# EasyEDA Pro project esp32_final.eprj

# Schematic SCH

## Sheets
1 ESP32
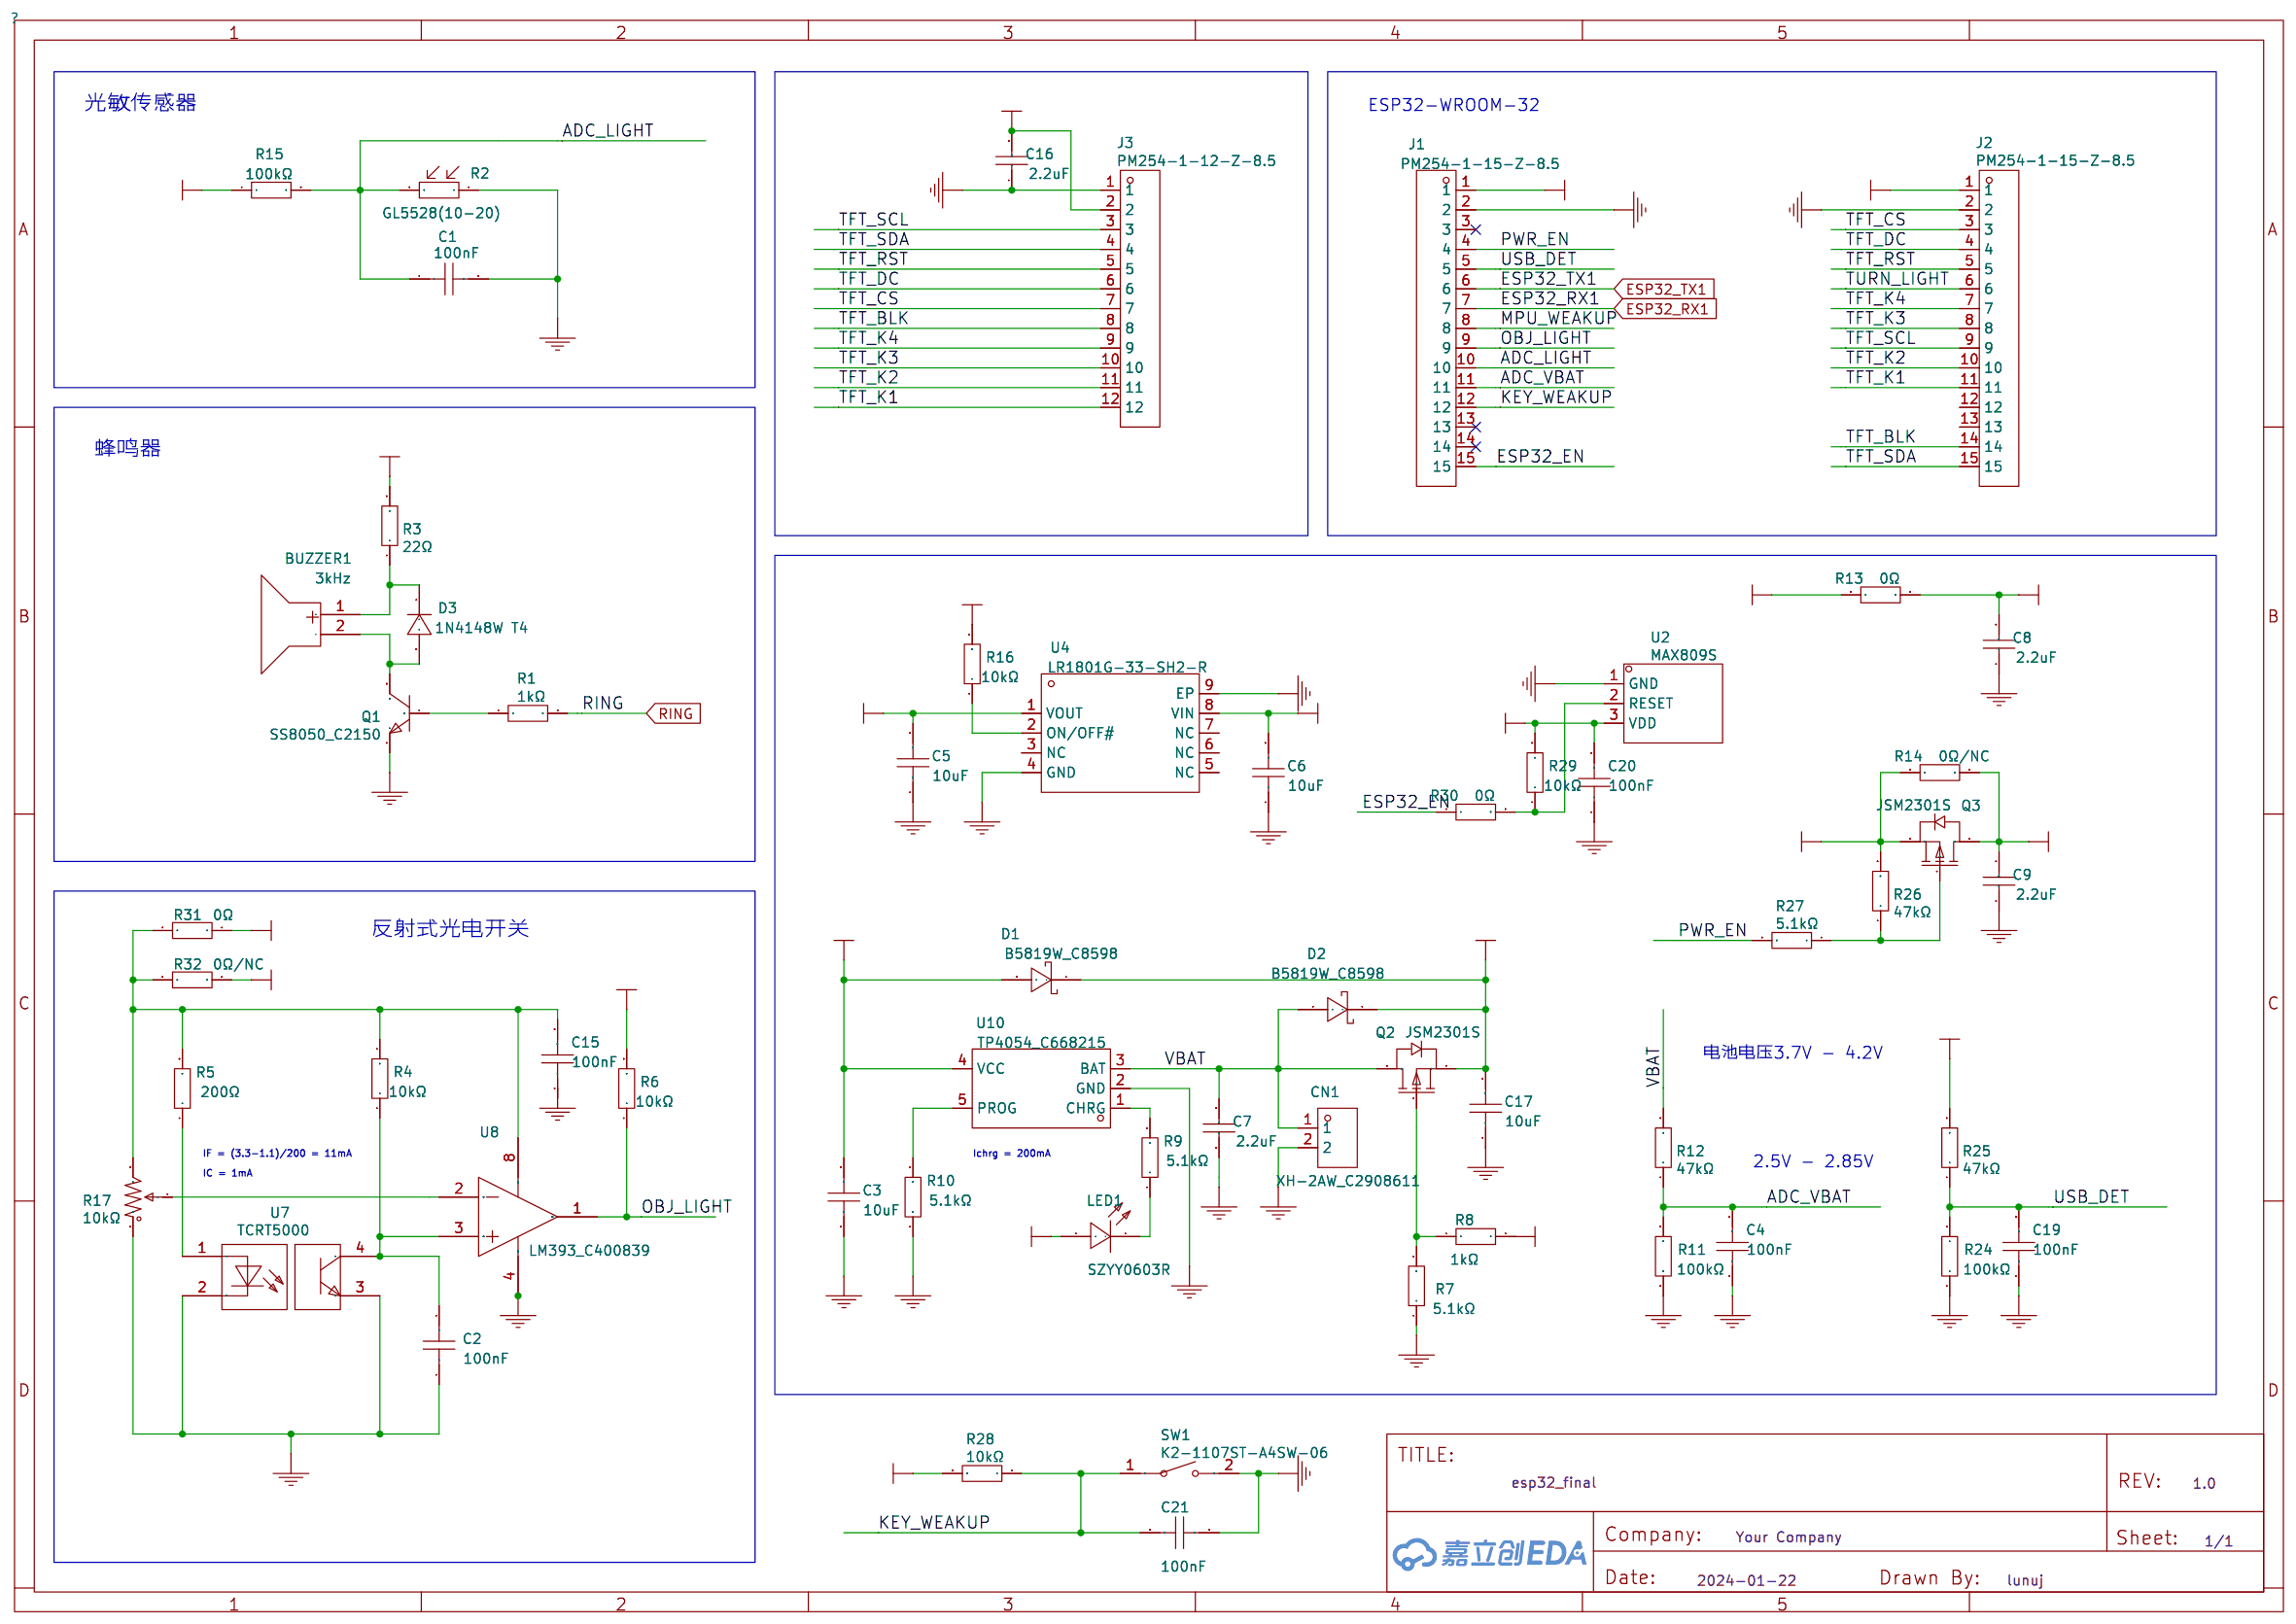
[diagram p0: ESP32]
2 STM32
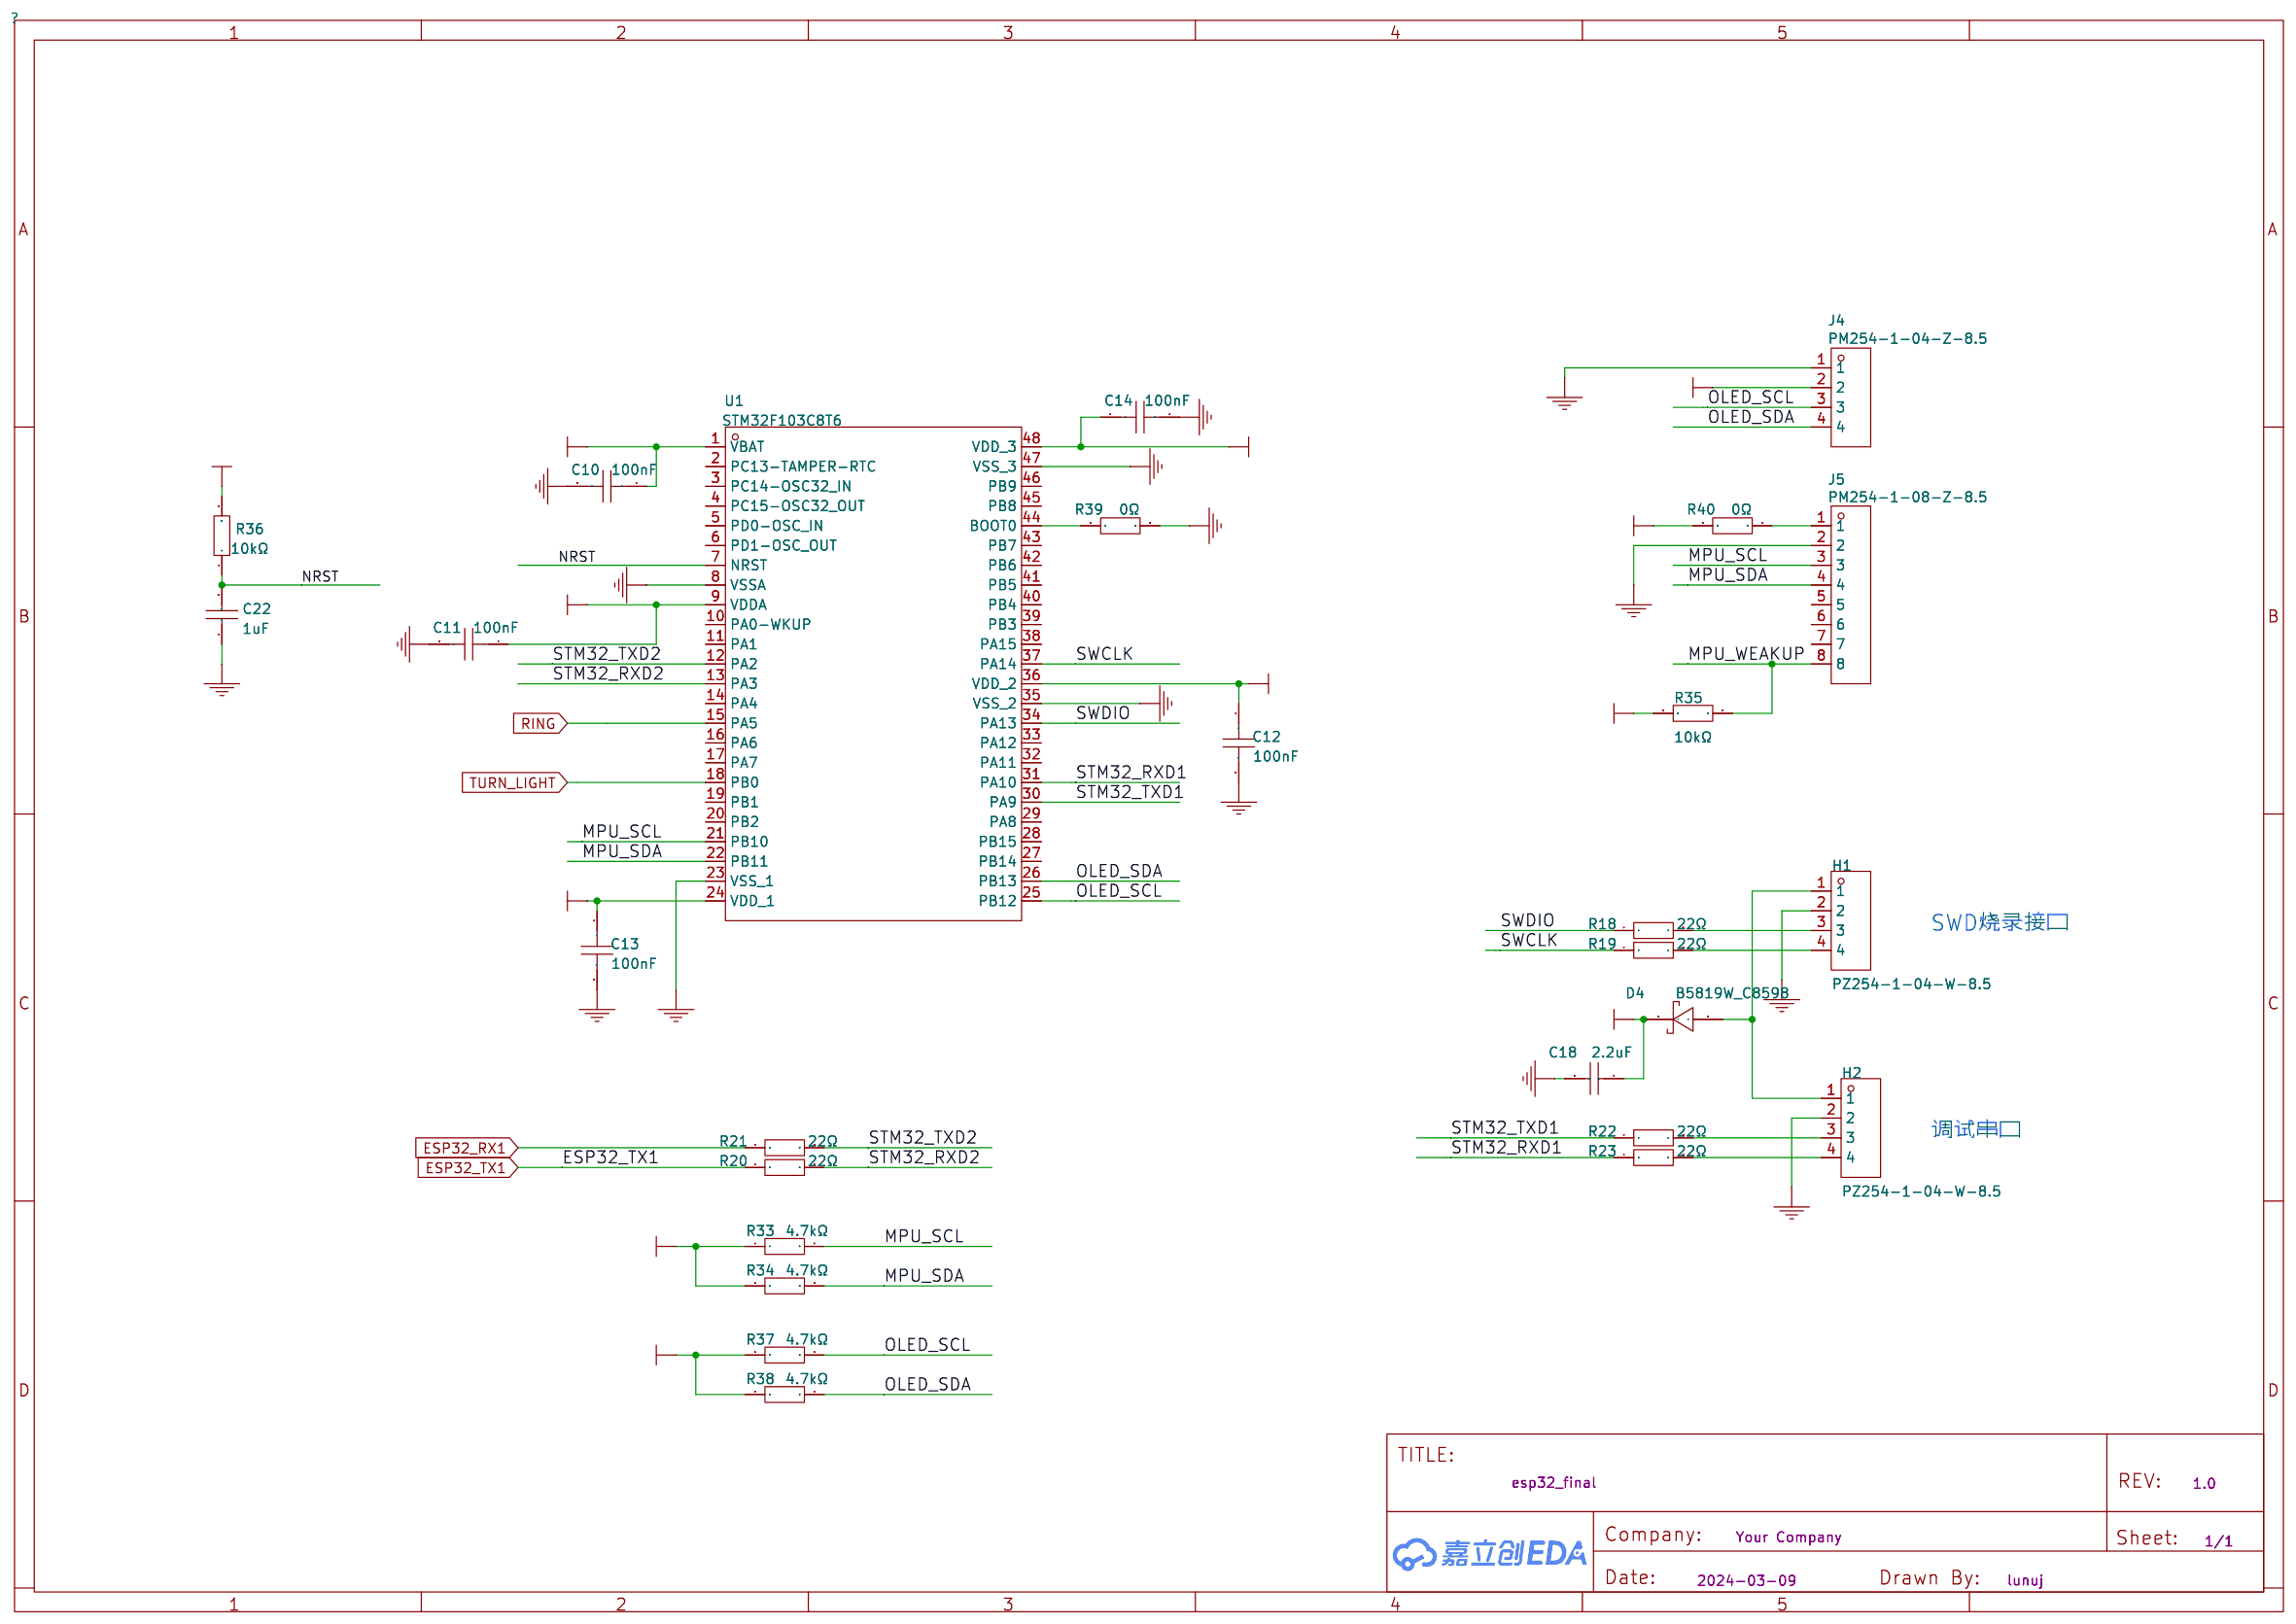
[diagram p1: STM32]

## Parts
sheet ESP32
BUZZER1  3kHz  [footprint_b725]
C1  100nF  [footprint_9e9b]
C2  100nF  [footprint_9e9b]
C3  10uF  [footprint_9e9b]
C4  100nF  [footprint_9e9b]
C5  10uF  [footprint_9e9b]
C6  10uF  [footprint_9e9b]
C7  2.2uF  [footprint_9e9b]
C8  2.2uF  [footprint_9e9b]
C9  2.2uF  [footprint_9e9b]
C15  100nF  [footprint_9e9b]
C16  2.2uF  [footprint_9e9b]
C17  10uF  [footprint_9e9b]
C19  100nF  [footprint_9e9b]
C20  100nF  [footprint_9e9b]
C21  100nF  [footprint_9e9b]
CN1  XH-2AW_C2908611  [footprint_45c2]
D1  B5819W_C8598  [footprint_217f]
D2  B5819W_C8598  [footprint_217f]
D3  1N4148W T4  [footprint_2996]
J1  PM254-1-15-Z-8.5  [footprint_1582]
J2  PM254-1-15-Z-8.5  [footprint_1582]
J3  PM254-1-12-Z-8.5  [footprint_c90a]
LED1  SZYY0603R  [footprint_3a94]
Q1  SS8050_C2150  [footprint_40fb]
Q2  JSM2301S  [footprint_40fb]
Q3  JSM2301S  [footprint_40fb]
R1  1kΩ  [footprint_ff81]
R2  GL5528(10-20)  [footprint_7788]
R3  22Ω  [footprint_ff81]
R4  10kΩ  [footprint_ff81]
R5  200Ω  [footprint_ff81]
R6  10kΩ  [footprint_ff81]
R7  5.1kΩ  [footprint_ff81]
R8  1kΩ  [footprint_ff81]
R9  5.1kΩ  [footprint_ff81]
R10  5.1kΩ  [footprint_ff81]
R11  100kΩ  [footprint_ff81]
R12  47kΩ  [footprint_ff81]
R13  0Ω  [footprint_ff81]
R14  0Ω/NC  [footprint_ff81]
R15  100kΩ  [footprint_ff81]
R16  10kΩ  [footprint_ff81]
R17  10kΩ  [footprint_5b8b]
R24  100kΩ  [footprint_ff81]
R25  47kΩ  [footprint_ff81]
R26  47kΩ  [footprint_ff81]
R27  5.1kΩ  [footprint_ff81]
R28  10kΩ  [footprint_ff81]
R29  10kΩ  [footprint_ff81]
R30  0Ω  [footprint_ff81]
R31  0Ω  [footprint_ff81]
R32  0Ω/NC  [footprint_ff81]
SW1  K2-1107ST-A4SW-06  [footprint_5031]
U2  MAX809S  [footprint_40fb]
U4  LR1801G-33-SH2-R  [footprint_c089]
U7  TCRT5000  [footprint_17ac]
U8  LM393_C400839  [footprint_6934]
U10  TP4054_C668215  [footprint_0cd8]
sheet STM32
C10  100nF  [footprint_9e9b]
C11  100nF  [footprint_9e9b]
C12  100nF  [footprint_9e9b]
C13  100nF  [footprint_9e9b]
C14  100nF  [footprint_9e9b]
C18  2.2uF  [footprint_9e9b]
C22  1uF  [C0603]
D4  B5819W_C8598  [footprint_217f]
H1  PZ254-1-04-W-8.5  [HDR-TH_04P-P2.54-H-M-W10.4-N]
H2  PZ254-1-04-W-8.5  [HDR-TH_04P-P2.54-H-M-W10.4-N]
J4  PM254-1-04-Z-8.5  [footprint_a6c7]
J5  PM254-1-08-Z-8.5  [footprint_d2a7]
R18  22Ω  [footprint_ff81]
R19  22Ω  [footprint_ff81]
R20  22Ω  [footprint_ff81]
R21  22Ω  [footprint_ff81]
R22  22Ω  [footprint_ff81]
R23  22Ω  [footprint_ff81]
R33  4.7kΩ  [R0603]
R34  4.7kΩ  [R0603]
R35  10kΩ  [footprint_ff81]
R36  10kΩ  [footprint_ff81]
R37  4.7kΩ  [R0603]
R38  4.7kΩ  [R0603]
R39  0Ω  [footprint_ff81]
R40  0Ω  [footprint_ff81]
U1  STM32F103C8T6  [footprint_1eac]

## Library data of the parts
BUZZER1 = 3kHz: Supplier: LCSC; Supplier Part: C96102; Manufacturer: 华能; Manufacturer Part: HNB09A03; JLCPCB Part Class: Extended Part
C1 C2 C4 C10-C15 C19-C21 = 100nF: Supplier: LCSC; Manufacturer: SAMSUNG(三星); Manufacturer Part: CL10B104KB8NNNC; Supplier Part: C1591; JLCPCB Part Class: Extended Part
C3 C5 C6 C17 = 10uF: Supplier: LCSC; Manufacturer: SAMSUNG(三星); Manufacturer Part: CL10A106KP8NNNC; Supplier Part: C19702; JLCPCB Part Class: Basic Part
C7-C9 C16 C18 = 2.2uF: Supplier: LCSC; Manufacturer Part: CL10A225KP8NNNC; Manufacturer: SAMSUNG(三星); Supplier Part: C1607; JLCPCB Part Class: Extended Part
CN1 = XH-2AW_C2908611: Supplier: LCSC; Supplier Part: C2908611; Manufacturer: HCTL(华灿天禄); Manufacturer Part: XH-2AW; JLCPCB Part Class: Extended Part
D1 D2 D4 = B5819W_C8598: Supplier: LCSC; Manufacturer: CJ(江苏长电/长晶); Manufacturer Part: B5819W SL; Supplier Part: C8598; JLCPCB Part Class: Basic Part
D3 = 1N4148W T4: Supplier: LCSC; Manufacturer: CJ(江苏长电/长晶); Manufacturer Part: 1N4148W; Supplier Part: C2099; JLCPCB Part Class: Extended Part
J1 J2 = PM254-1-15-Z-8.5: Supplier: LCSC; Supplier Part: C2897378; Manufacturer: HCTL(华灿天禄); JLCPCB Part Class: Extended Part
J3 = PM254-1-12-Z-8.5: Supplier: LCSC; Supplier Part: C2897375; Manufacturer: HCTL(华灿天禄); JLCPCB Part Class: Extended Part
LED1 = SZYY0603R: Supplier: LCSC; Supplier Part: C434419; Manufacturer: yongyu(永裕光电); JLCPCB Part Class: Extended Part
Q1 = SS8050_C2150: Supplier: LCSC; Manufacturer: CJ(江苏长电/长晶); Manufacturer Part: SS8050; Supplier Part: C2150; JLCPCB Part Class: Basic Part
Q2 Q3 = JSM2301S: Supplier: LCSC; Supplier Part: C916399; Manufacturer: JSMSEMI(杰盛微); JLCPCB Part Class: Extended Part
R1 R8 = 1kΩ: Supplier: LCSC; Manufacturer Part: RC0603FR-071KL; Manufacturer: YAGEO(国巨); Supplier Part: C22548; JLCPCB Part Class: Extended Part
R2 = GL5528(10-20): Supplier: LCSC; Manufacturer: JCHL(晶创和立); Supplier Part: C10081; JLCPCB Part Class: Extended Part
R3 R18-R23 = 22Ω: Supplier: LCSC; Manufacturer: UNI-ROYAL(厚声); Manufacturer Part: 0603WAF220JT5E; Supplier Part: C23345; JLCPCB Part Class: Basic Part
R4 R6 R16 R28 R29 R35 R36 = 10kΩ: Supplier: LCSC; Manufacturer: UNI-ROYAL(厚声); Manufacturer Part: 0603WAF1002T5E; Supplier Part: C25804; JLCPCB Part Class: Basic Part
R5 = 200Ω: Supplier: LCSC; Manufacturer: UNI-ROYAL(厚声); Manufacturer Part: 0603WAJ0201T5E; Supplier Part: C25217; JLCPCB Part Class: Extended Part
R7 R9 R10 R27 = 5.1kΩ: Supplier: LCSC; Manufacturer Part: 0603WAF5101T5E; Manufacturer: UNI-ROYAL(厚声); Supplier Part: C23186; JLCPCB Part Class: Basic Part
R11 R15 R24 = 100kΩ: Supplier: LCSC; Supplier Part: C14675; Manufacturer: YAGEO(国巨); Manufacturer Part: RC0603FR-07100KL; JLCPCB Part Class: Extended Part
R12 R25 R26 = 47kΩ: Supplier: LCSC; Manufacturer: UNI-ROYAL(厚声); Manufacturer Part: 0603WAF4702T5E; Supplier Part: C25819; JLCPCB Part Class: Basic Part
R13 R30-R32 R39 R40 = 0Ω: Supplier: LCSC; Manufacturer: UNI-ROYAL(厚声); Manufacturer Part: 0603WAF0000T5E; Supplier Part: C21189; JLCPCB Part Class: Basic Part
R14 = 0Ω/NC: Supplier: LCSC; Manufacturer: UNI-ROYAL(厚声); Manufacturer Part: 0603WAF0000T5E; Supplier Part: C21189; JLCPCB Part Class: Basic Part
R17 = 10kΩ: Resistance: 10K; Supplier: LCSC; Supplier Part: C118956; Manufacturer: BOCHEN(博晨); Manufacturer Part: 3362P-1-103; JLCPCB Part Class: Extended Part
SW1 = K2-1107ST-A4SW-06: Supplier: LCSC; Supplier Part: C118141; Manufacturer: 韩国韩荣; Manufacturer Part: K2-1107ST-A4DW-06; JLCPCB Part Class: Extended Part
U2 = MAX809S: Supplier: LCSC; Supplier Part: C347371; Manufacturer: UMW(友台半导体); JLCPCB Part Class: Extended Part
U4 = LR1801G-33-SH2-R: Supplier: LCSC; Supplier Part: C410479; Manufacturer: UTC(友顺); JLCPCB Part Class: Extended Part
U7 = TCRT5000: Supplier: LCSC; Supplier Part: C2984661; Manufacturer: VISHAY(威世); JLCPCB Part Class: Extended Part
U8 = LM393_C400839: Supplier: LCSC; Supplier Part: C400839; Manufacturer: IDCHIP(英锐芯); Manufacturer Part: LM393; JLCPCB Part Class: Extended Part
U10 = TP4054_C668215: Supplier: LCSC; Supplier Part: C668215; Manufacturer: UMW(友台半导体); Manufacturer Part: TP4054; JLCPCB Part Class: Extended Part
C22 = CL10A105KO8NNNC: 容值:1uF;精度:±10%;额定电压:16V;材质(温度系数):X5R;; LCSC Part Name: 1uF ±10% 16V; Supplier Part: C1592; Manufacturer: SAMSUNG(三星); Supplier Footprint: 0603; JLCPCB Part Class: 扩展库; Datasheet: https://atta.szlcsc.com/upload/public/pdf/source/20220919/9FBE606BE0D9532D730F292EB26DC5BB.pdf; Supplier: LCSC; Tolerance: ±10%; Voltage Rated: 16V; Temperature Coefficient: X5R
H1 H2 = PZ254-1-04-W-8.5: 插针结构:1x4P;间距:2.54mm;行距:-;圆针/方针:方针;安装类型:弯插;排数:单排;总PIN位数:4P;额定电流:3A;额定电压:-;配合针长度:6mm;塑高:2.5mm;端接针长度:-;触头材质:-;工作温度范围:-40℃~+105℃;焊接温度(最大值):260℃@10S;颜色:黑色;; LCSC Part Name: 1x4P 间距:2.54mm 方针 弯插; Supplier Part: C2894946; Manufacturer: HCTL(华灿天禄); Supplier Footprint: 弯插,P=2.54mm; JLCPCB Part Class: 扩展库; Datasheet: https://atta.szlcsc.com/upload/public/pdf/source/20230609/872AF364EDF8DB2CAF0930EAB94ECB6E.pdf; Supplier: LCSC; Pin Structure: 1x4P; Pitch: 2.54mm; Circluar Pins/Square Pins: 方针; Mounting Type: 弯插; Number of Rows: 单排; Number of Pins: 4P; Current Rating (Max): 3A; Length of Mating Pin: 6mm; Insulation Height: 2.5mm; Operating Temperature Range: -40℃~+105℃; Soldering Temperature(Max): 260℃@10S; Color: 黑色
J4 = PM254-1-04-Z-8.5: Supplier: LCSC; Supplier Part: C2897367; Manufacturer: HCTL(华灿天禄); JLCPCB Part Class: Extended Part
J5 = PM254-1-08-Z-8.5: Supplier: LCSC; Supplier Part: C2897371; Manufacturer: HCTL(华灿天禄); JLCPCB Part Class: Extended Part
R33 R34 R37 R38 = 0603WAF4701T5E: 电阻类型:厚膜电阻;阻值:4.7kΩ;精度:±1%;功率:100mW;最大工作电压:75V;温度系数:±100ppm/℃;; LCSC Part Name: 4.7kΩ ±1% 100mW 厚膜电阻; Supplier Part: C23162; Manufacturer: UNI-ROYAL(厚声); Supplier Footprint: 0603; JLCPCB Part Class: 基础库; Datasheet: https://atta.szlcsc.com/upload/public/pdf/source/20200306/C422600_1E6D84923E4A46A82E41ADD87F860B5C.pdf; Supplier: LCSC; Type: 厚膜电阻; Tolerance: ±1%; Power(Watts): 100mW; Overload Voltage (Max): 75V; Temperature Coefficient: ±100ppm/℃; Operating Temperature Range: -55℃~+155℃
U1 = STM32F103C8T6: Supplier Part: C8734; Supplier: LCSC; Manufacturer: ST(意法半导体); JLCPCB Part Class: Extended Part

## Nets
GND: C1.2 C2.1 C3.1 C4.1 C5.1 C6.1 C7.1 C8.1 C9.1 C10.2 C11.2 C12.2 C13.2 C14.1 C15.1 C16.1 C17.1 C18.2 C19.1 C20.1 C21.1 C22.1 CN1.2 H1.2 H2.2 J1.2 J2.2 J3.1 J4.1 J5.2 Q1.2(E) R2.1 R7.1 R10.1 R11.1 R17.1 R24.1 R39.2 SW1.2 U1.8(VSSA) U1.23(VSS_1) U1.35(VSS_2) U1.47(VSS_3) U2.1(GND) U4.4(GND) U4.9(EP) U7.2 U7.3 U8.4(GND) U10.2(GND)
V33: C5.2 Q3.2(S) R13.1 R14.1 R26.2 U4.1(VOUT)
VBAT: C7.2 CN1.1 D2.2(+) Q2.3(D) R12.2 U10.3(BAT)
VBUS: C6.2 C17.2 D1.1(-) D2.1(-) Q2.2(S) R16.2 R40.1 U4.8(VIN)
VCC3V3: C9.2 C10.1 C11.1 C12.1 C13.1 C14.2 C16.2 C18.1 D4.1(-) J3.2 J4.2 Q3.3(D) R3.2 R14.2 R15.1 R32.1 R33.1 R34.1 R36.2 R37.1 R38.1 U1.1(VBAT) U1.9(VDDA) U1.24(VDD_1) U1.36(VDD_2) U1.48(VDD_3)
VDD3V3: C8.2 C20.2 J2.1 R6.2 R13.2 R28.2 R29.2 R31.1 R35.2 U2.3(VDD)
VIN: C3.2 D1.2(+) J1.1 LED1.1(+) R8.2 R25.2 U10.4(VCC)
ADC_LIGHT: C1.1 J1.10 R2.2 R15.2
ADC_VBAT: C4.2 J1.11 R11.2 R12.1
ESP32_EN: J1.15 R30.1
ESP32_RX1: J1.7 R21.1
ESP32_TX1: J1.6 R20.1
H1_1: D4.2(+) H1.1 H2.1
H1_3: H1.3 R18.2
H1_4: H1.4 R19.2
H2_3: H2.3 R22.2
H2_4: H2.4 R23.2
KEY_WEAKUP: C21.2 J1.12 R28.1 SW1.1
MPU_SCL: J5.3 R33.2 U1.21(PB10)
MPU_SDA: J5.4 R34.2 U1.22(PB11)
MPU_WEAKUP: J1.8 J5.8 R35.1
NRST: C22.2 R36.1 U1.7(NRST)
OBJ_LIGHT: J1.9 R6.1 U8.1(OUTA)
OLED_SCL: J4.3 R37.2 U1.25(PB12)
OLED_SDA: J4.4 R38.2 U1.26(PB13)
PWR_EN: J1.4 R27.2
RING: R1.2 U1.15(PA5)
STM32_RXD1: R23.1 U1.31(PA10)
STM32_RXD2: R20.2 U1.13(PA3)
STM32_TXD1: R22.1 U1.30(PA9)
STM32_TXD2: R21.2 U1.12(PA2)
SWCLK: R19.1 U1.37(PA14)
SWDIO: R18.1 U1.34(PA13)
TFT_BLK: J2.14 J3.8
TFT_CS: J2.3 J3.7
TFT_DC: J2.4 J3.6
TFT_K1: J2.11 J3.12
TFT_K2: J2.10 J3.11
TFT_K3: J2.8 J3.10
TFT_K4: J2.7 J3.9
TFT_RST: J2.5 J3.5
TFT_SCL: J2.9 J3.3
TFT_SDA: J2.15 J3.4
TURN_LIGHT: J2.6 U1.18(PB0)
USB_DET: C19.2 J1.5 R24.2 R25.1
$1N12: C2.2 R4.1 U7.4 U8.3(INA+)
$1N13: R17.2 U8.2(INA-)
$1N15: R5.1 U7.1
$1N25: BUZZER1.1(+) D3.1(K) R3.1
$1N26: BUZZER1.2(-) D3.2(A) Q1.3(C)
$1N28: Q1.1(B) R1.1
$1N42: R9.2 U10.1(CHRG)
$1N45: Q2.1(G) R7.2 R8.1
$1N51: R10.2 U10.5(PROG)
$1N72: R16.1 U4.2(ON/OFF#)
$1N77: LED1.2(-) R9.1
$1N88: Q3.1(G) R26.1 R27.1
$1N98: R29.1 R30.2 U2.2(RESET)
$2N23: J5.1 R40.2
$2N2076: R39.1 U1.44(BOOT0)
Net-(C15-2): C15.2 R4.2 R5.2 R17.3 R31.2 R32.2 U8.8(VCC)

Not connected (* = marked no-connect by the designer): J1 3* 13* 14*; J2 12 13; J5 5 6 7; U1 2(PC13-TAMPER-RTC) 3(PC14-OSC32_IN) 4(PC15-OSC32_OUT) 5(PD0-OSC_IN) 6(PD1-OSC_OUT) 10(PA0-WKUP) 11(PA1) 14(PA4) 16(PA6) 17(PA7) 19(PB1) 20(PB2) 27(PB14) 28(PB15) 29(PA8) 32(PA11) 33(PA12) 38(PA15) 39(PB3) 40(PB4) 41(PB5) 42(PB6) 43(PB7) 45(PB8) 46(PB9); U4 3(NC) 5(NC) 6(NC) 7(NC)

## Notes on the sheets
sheet 1
- 光敏传感器
- ESP32-WROOM-32
- 蜂鸣器
- 反射式光电开关
- 电池电压3.7V - 4.2V
- IF = (3.3-1.1)/200 = 11mA
- Ichrg = 200mA
- 2.5V - 2.85V
- IC = 1mA
sheet 2
- SWD烧录接口
- 调试串口

# Board ESP32_STM32_PCB_V0.1
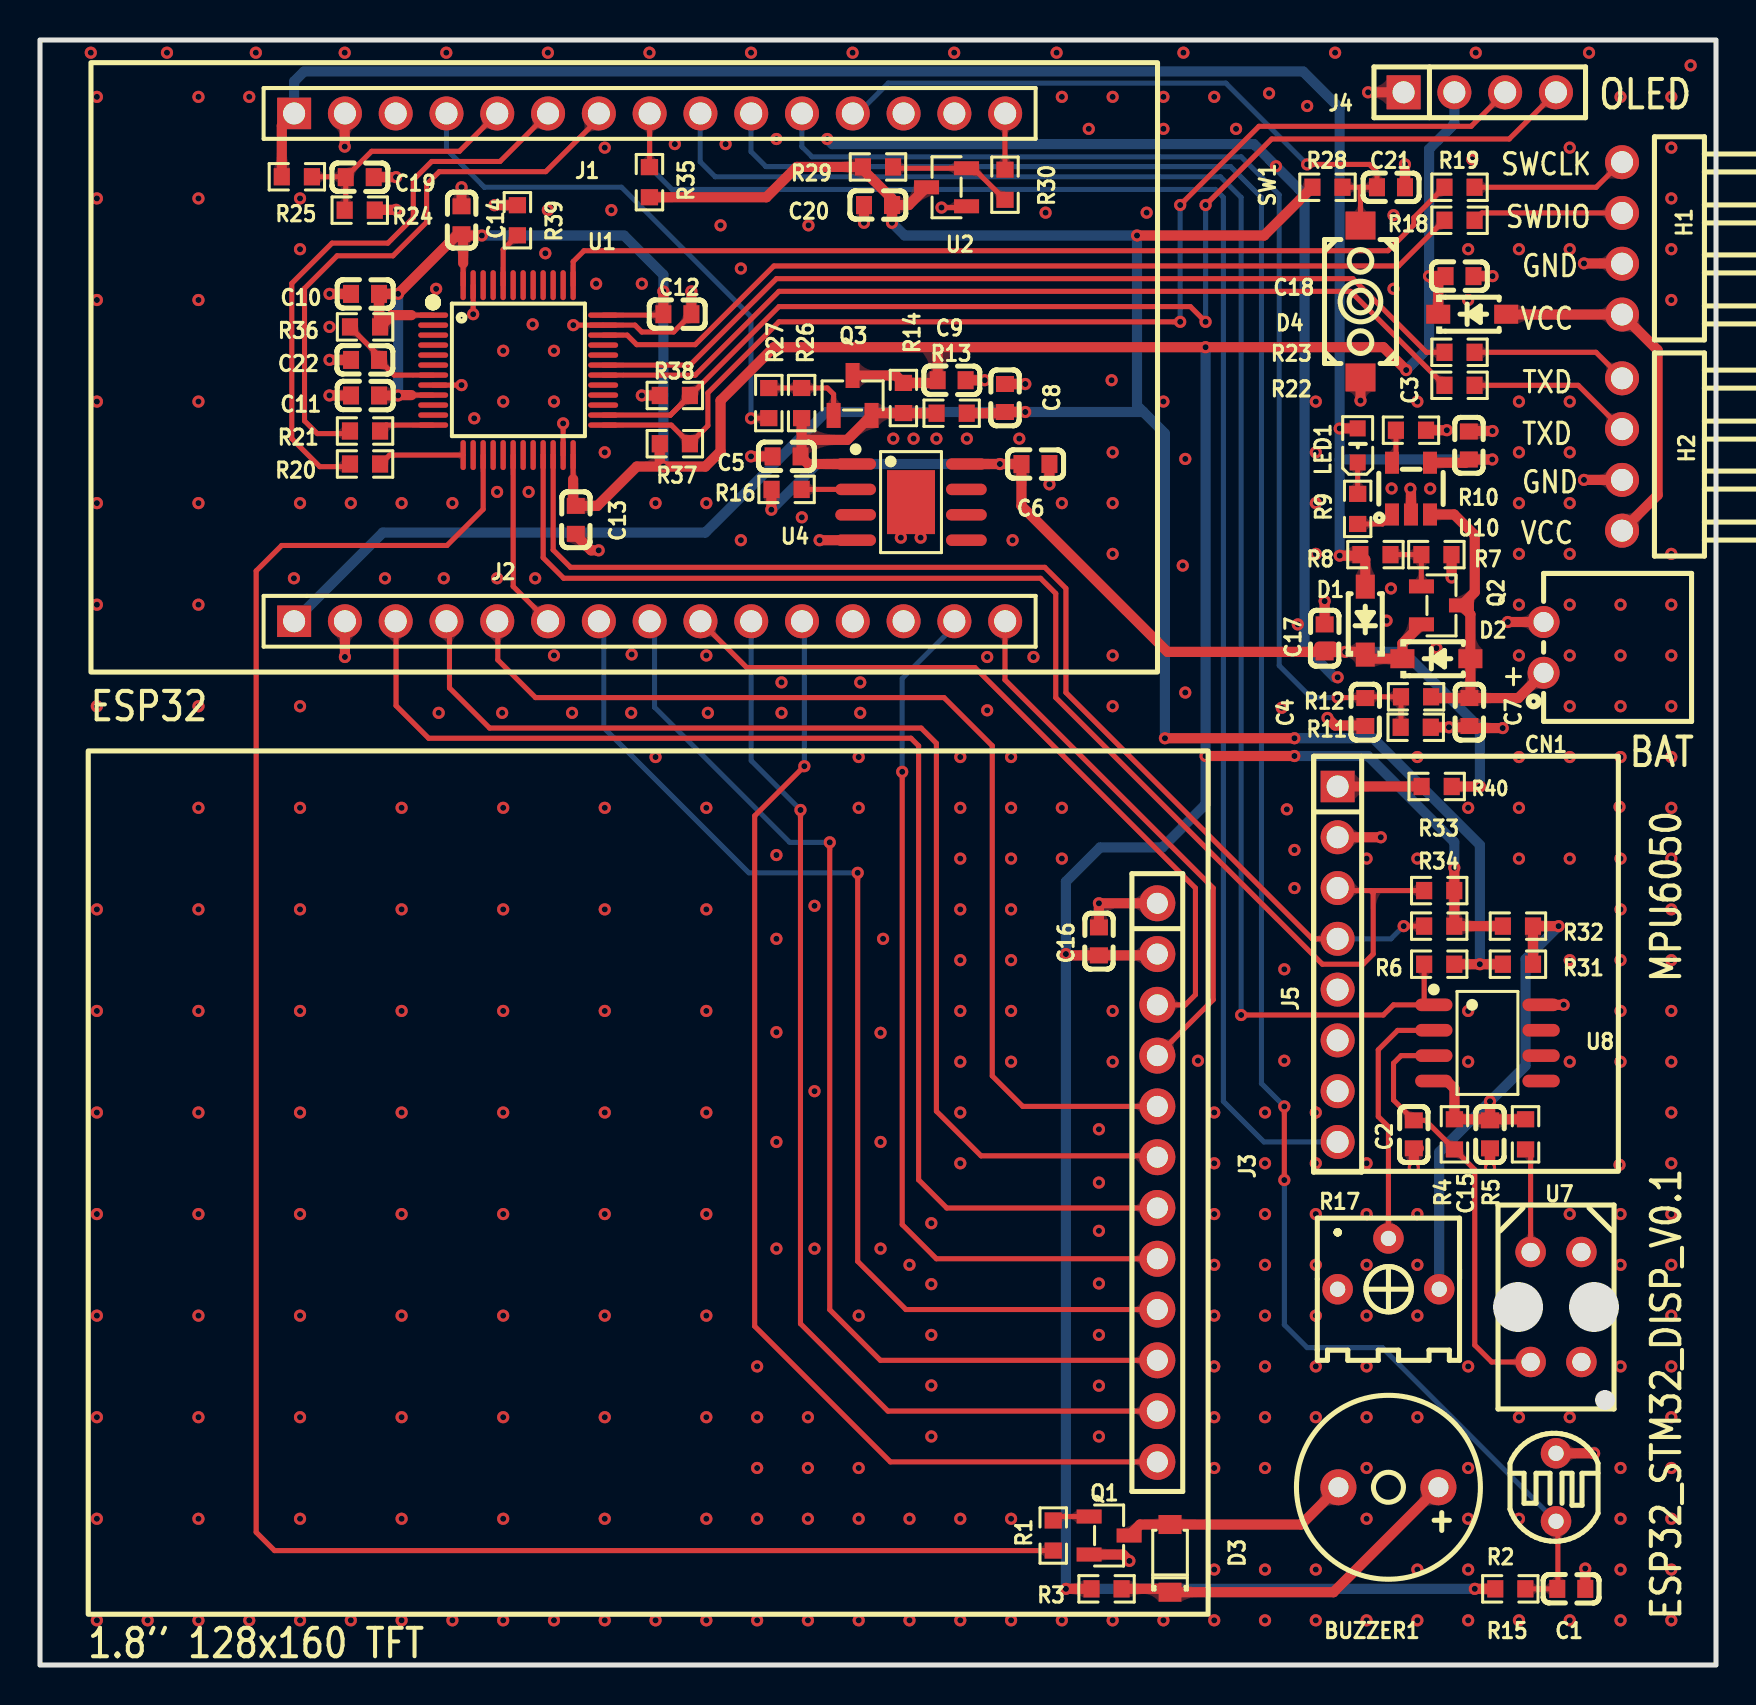
[diagram p2: board, top side]
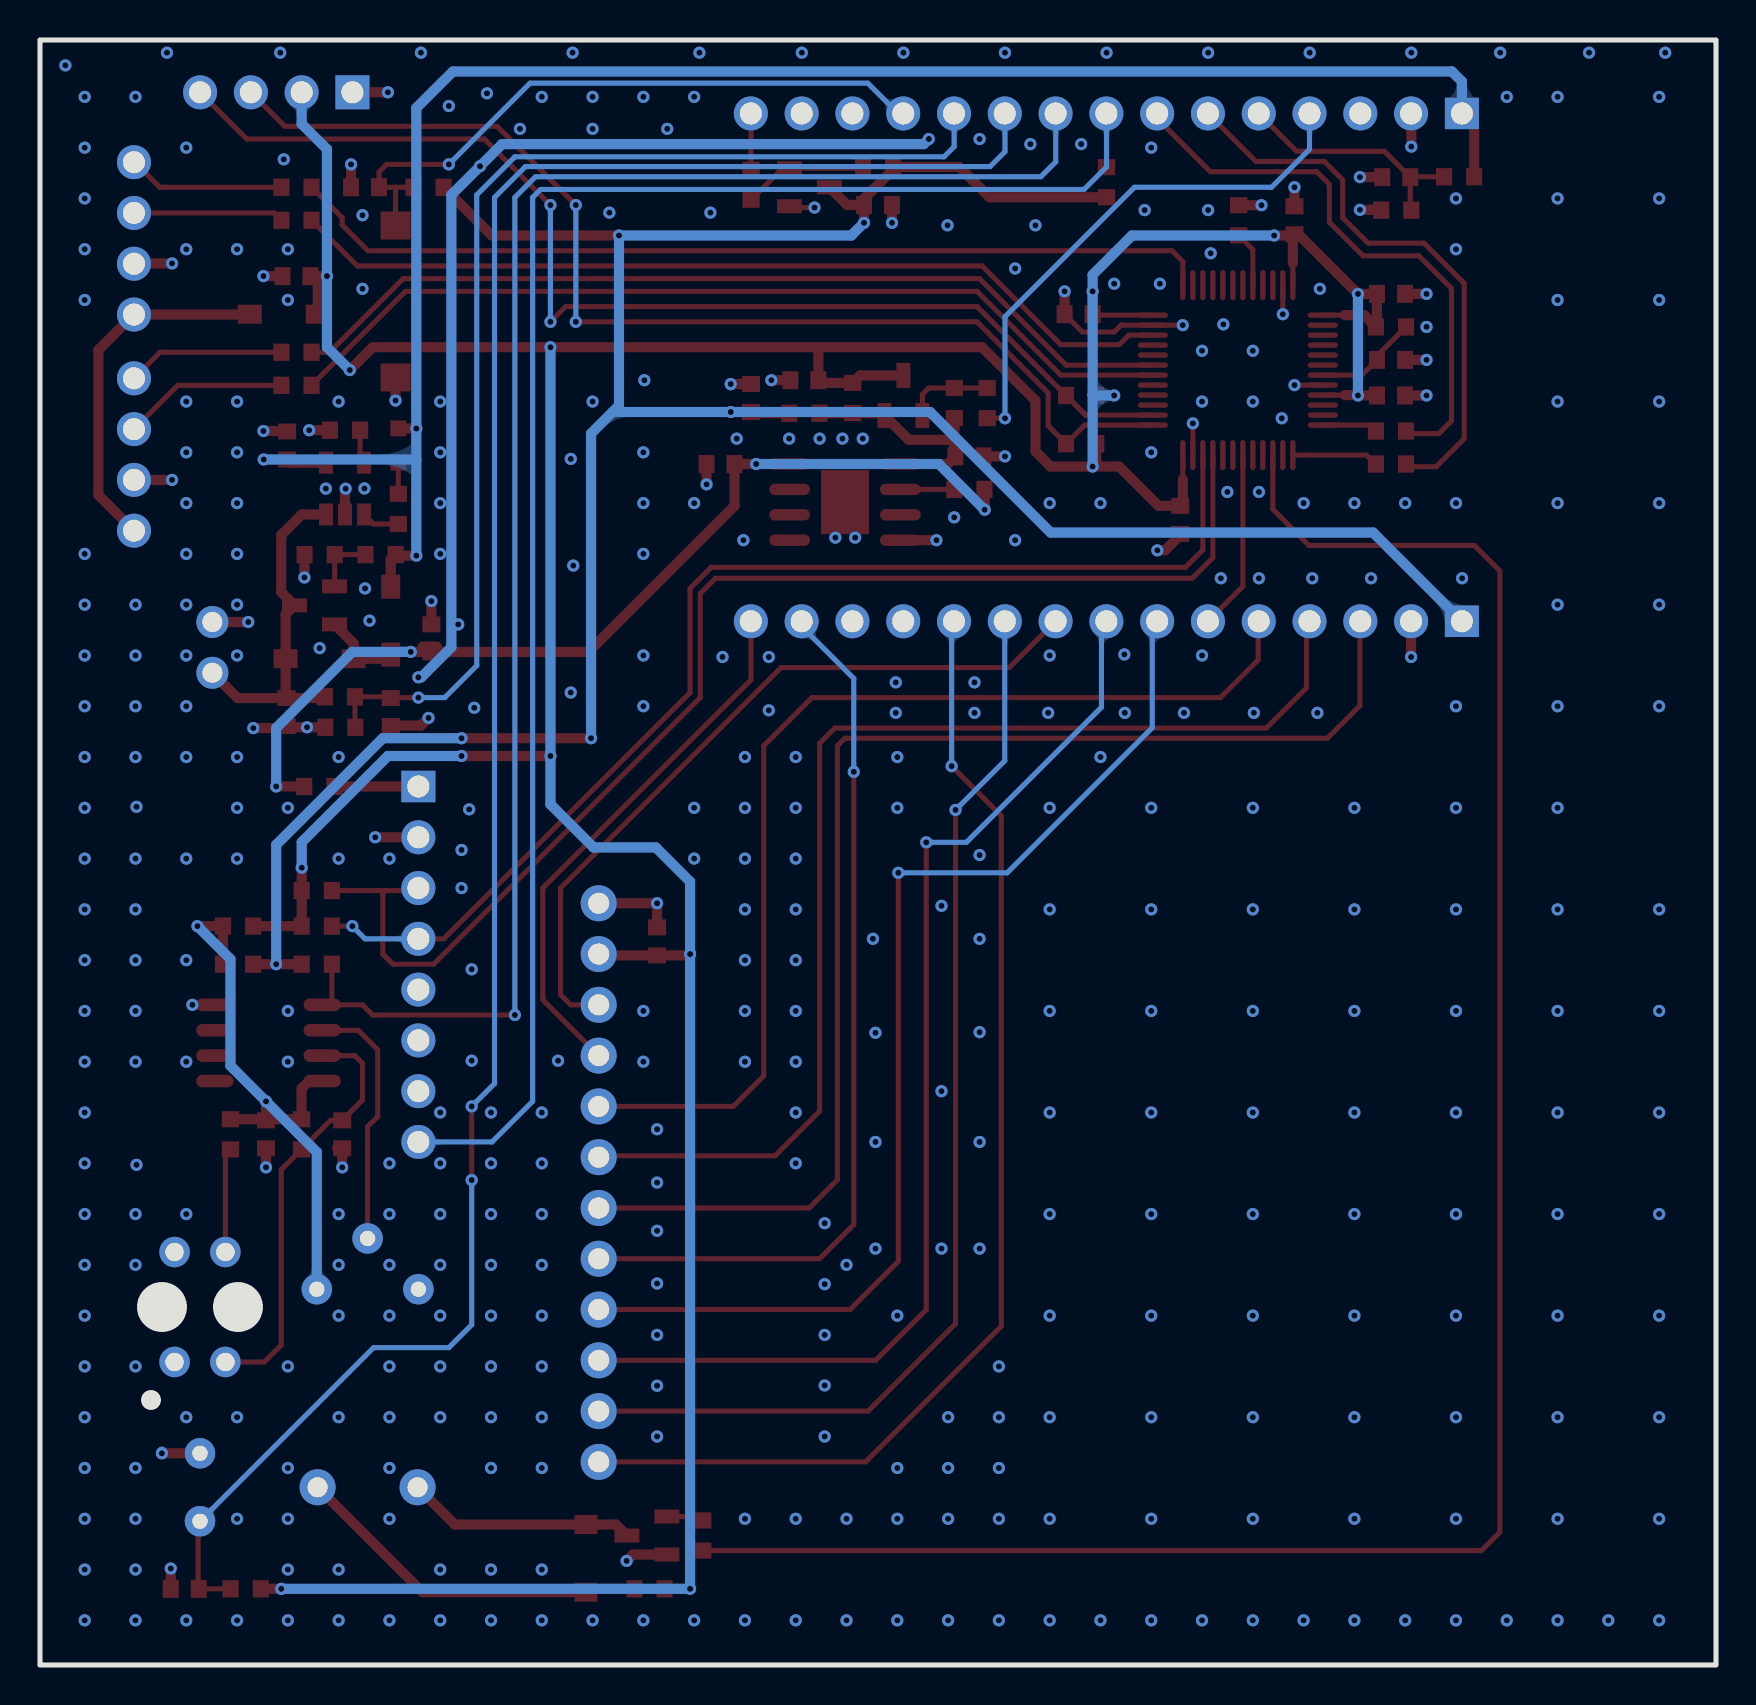
[diagram p3: board, bottom side, seen from below]

Outline 83.82 x 81.28 mm; copper layers: Top Layer, Bottom Layer. Coordinates in mm from the lower left corner of the outline.
Outline path: rectangle 0,81.28 83.82,0
Stack: Top Layer 0.035mm / Dielectric1 1.51mm FR4 er 4.5 / Bottom Layer 0.035mm

## Design rules (mm)
template: 用户自定义配置
spacing Default (default): track to track 0.203, other pairs 0.203 to 0.254
spacing safeClearance1-mcu: track to track 0.203, other pairs 0.203 to 0.203
track width Default (default): min 0.203, default 0.254, max 25.4
track width pwr: min 0.254, default 0.508, max 2.54
differential pair differentialPair (default): width min 0.127, default 0.254, max 2.54; gap min 0.152, default 0.152
via Default (default): diameter min 0.61, default 0.61, max 100.025; hole min 0.305, default 0.305, max 59.995
net GND uses pwr
net VIN uses pwr
net V33 uses pwr
net VBUS uses pwr
net VBAT uses pwr
net VDD3V3 uses pwr
net VCC3V3 uses pwr
region e3149 uses safeClearance1-mcu

## Placement (name value [footprint] x y rotation side)
BUZZER1  3kHz  [footprint_b725]  67.44 8.89 180 top
C1  100nF  [footprint_9e9b]  76.58 3.81 0 top
C2  100nF  [footprint_9e9b]  68.71 26.54 90 top
C3  10uF  [footprint_9e9b]  71.46 61 270 top
C4  100nF  [footprint_9e9b]  66.28 47.67 90 top
C5  10uF  [footprint_9e9b]  37.34 60.45 0 top
C6  10uF  [footprint_9e9b]  49.78 60.07 180 top
C7  2.2uF  [footprint_9e9b]  71.49 47.67 90 top
C8  2.2uF  [footprint_9e9b]  48.26 63.37 270 top
C9  2.2uF  [footprint_9e9b]  45.59 64.26 180 top
C10  100nF  [footprint_9e9b]  16.26 68.58 180 top
C11  100nF  [footprint_9e9b]  16.26 63.5 180 top
C12  100nF  [footprint_9e9b]  31.88 67.56 0 top
C13  100nF  [footprint_9e9b]  26.8 57.28 270 top
C14  100nF  [footprint_9e9b]  21.08 72.26 270 top
C15  100nF  [footprint_9e9b]  72.52 26.54 90 top
C16  2.2uF  [footprint_9e9b]  52.96 36.19 270 top
C17  10uF  [footprint_9e9b]  64.25 51.35 270 top
C18  2.2uF  [footprint_9e9b]  70.99 69.47 0 top
C19  100nF  [footprint_9e9b]  15.99 74.42 180 top
C20  100nF  [footprint_9e9b]  41.91 73.03 0 top
C21  100nF  [footprint_9e9b]  67.56 73.91 180 top
C22  1uF  [C0603]  16.26 65.28 0 top
CN1  XH-2AW_C2908611  [footprint_45c2]  75.2 50.9 90 top
D1  B5819W_C8598  [footprint_217f]  66.28 52.24 90 top
D2  B5819W_C8598  [footprint_217f]  69.84 50.33 0 top
D3  1N4148W T4  [footprint_2996]  56.51 5.33 90 top
D4  B5819W_C8598  [footprint_217f]  71.63 67.56 0 top
H1  PZ254-1-04-W-8.5  [HDR-TH_04P-P2.54-H-M-W10.4-N]  79.12 71.36 90 top
H2  PZ254-1-04-W-8.5  [HDR-TH_04P-P2.54-H-M-W10.4-N]  79.12 60.55 90 top
J1  PM254-1-15-Z-8.5  [footprint_1582]  30.49 77.61 0 top
J2  PM254-1-15-Z-8.5  [footprint_1582]  30.49 52.21 0 top
J3  PM254-1-12-Z-8.5  [footprint_c90a]  55.88 24.13 270 top
J4  PM254-1-04-Z-8.5  [footprint_a6c7]  72 78.66 0 top
J5  PM254-1-08-Z-8.5  [footprint_d2a7]  64.9 35.05 270 top
LED1  SZYY0603R  [footprint_3a94]  65.9 61 90 top
Q1  SS8050_C2150  [footprint_40fb]  53.47 6.48 180 top
Q2  JSM2301S  [footprint_40fb]  70.09 53 180 top
Q3  JSM2301S  [footprint_40fb]  40.64 63.5 270 top
R1  1kΩ  [footprint_ff81]  50.67 6.48 270 top
R2  GL5528(10-20)  [footprint_7788]  75.82 8.89 0 top
R3  22Ω  [footprint_ff81]  53.34 3.81 180 top
R4  10kΩ  [footprint_ff81]  70.74 26.54 90 top
R5  200Ω  [footprint_ff81]  74.29 26.54 90 top
R6  10kΩ  [footprint_ff81]  69.98 35.05 0 top
R7  5.1kΩ  [footprint_ff81]  69.84 55.54 180 top
R8  1kΩ  [footprint_ff81]  66.79 55.54 180 top
R9  5.1kΩ  [footprint_ff81]  65.9 57.83 270 top
R10  5.1kΩ  [footprint_ff81]  68.57 61.76 180 top
R11  100kΩ  [footprint_ff81]  68.8 46.9 180 top
R12  47kΩ  [footprint_ff81]  68.82 48.43 0 top
R13  0Ω  [footprint_ff81]  45.59 62.61 0 top
R14  0Ω/NC  [footprint_ff81]  43.18 63.37 90 top
R15  100kΩ  [footprint_ff81]  73.53 3.81 0 top
R16  10kΩ  [footprint_ff81]  37.34 58.8 180 top
R17  10kΩ  [footprint_5b8b]  67.44 20.07 0 top
R18  22Ω  [footprint_ff81]  70.99 72.26 0 top
R19  22Ω  [footprint_ff81]  70.99 73.91 0 top
R20  22Ω  [footprint_ff81]  16.26 60.07 0 top
R21  22Ω  [footprint_ff81]  16.26 61.72 0 top
R22  22Ω  [footprint_ff81]  70.99 64.01 0 top
R23  22Ω  [footprint_ff81]  70.99 65.66 0 top
R24  100kΩ  [footprint_ff81]  15.99 72.77 180 top
R25  47kΩ  [footprint_ff81]  12.85 74.44 180 top
R26  47kΩ  [footprint_ff81]  38.09 63.12 270 top
R27  5.1kΩ  [footprint_ff81]  36.45 63.12 270 top
R28  10kΩ  [footprint_ff81]  64.39 73.91 180 top
R29  10kΩ  [footprint_ff81]  41.91 74.93 180 top
R30  0Ω  [footprint_ff81]  48.26 74.04 270 top
R31  0Ω  [footprint_ff81]  73.91 35.05 0 top
R32  0Ω/NC  [footprint_ff81]  73.91 36.96 0 top
R33  4.7kΩ  [R0603]  69.98 38.73 180 top
R34  4.7kΩ  [R0603]  69.98 36.96 180 top
R35  10kΩ  [footprint_ff81]  30.48 74.17 270 top
R36  10kΩ  [footprint_ff81]  16.26 66.93 0 top
R37  4.7kΩ  [R0603]  31.75 61.09 0 top
R38  4.7kΩ  [R0603]  31.75 63.5 0 top
R39  0Ω  [footprint_ff81]  23.88 72.26 90 top
R40  0Ω  [footprint_ff81]  69.85 43.94 180 top
SW1  K2-1107ST-A4SW-06  [footprint_5031]  66.04 68.2 270 top
U1  STM32F103C8T6  [footprint_1eac]  23.91 64.77 270 top
U2  MAX809S  [footprint_40fb]  45.34 73.91 0 top
U4  LR1801G-33-SH2-R  [footprint_c089]  43.56 58.17 270 top
U7  TCRT5000  [footprint_17ac]  75.82 17.91 90 top
U8  LM393_C400839  [footprint_6934]  72.39 31.11 270 top
U10  TP4054_C668215  [footprint_0cd8]  68.57 58.84 270 top

## Footprints (pads in the part's own frame, mm; a bottom-side part is the same pattern mirrored in y, then rotated)
C0603
  rect 0.8x0.9 smd: 1(-0.7,0) 2(0.7,0)
footprint_0cd8
  rect 1.1x0.7 smd: 1(1.294,-0.951) 2(1.294,-0.001) 3(1.294,0.951) 4(-1.294,0.951) 5(-1.294,-0.949)
footprint_1eac
  oval 0.27x1.5 smd: 1(-2.75,-4.25) 2(-2.25,-4.25) 3(-1.75,-4.25) 4(-1.25,-4.25) 5(-0.75,-4.25) 6(-0.25,-4.25) 7(0.25,-4.25) 8(0.75,-4.25) 9(1.25,-4.25) 10(1.75,-4.25) 11(2.25,-4.25) 12(2.75,-4.25) 25(2.75,4.25) 26(2.25,4.25) 27(1.75,4.25) 28(1.25,4.25) 29(0.75,4.25) 30(0.25,4.25) 31(-0.25,4.25) 32(-0.75,4.25) 33(-1.25,4.25) 34(-1.75,4.25) 35(-2.25,4.25) 36(-2.75,4.25)
  oval 1.5x0.27 smd: 13(4.25,-2.75) 14(4.25,-2.25) 15(4.25,-1.75) 16(4.25,-1.25) 17(4.25,-0.75) 18(4.25,-0.25) 19(4.25,0.25) 20(4.25,0.75) 21(4.25,1.25) 22(4.25,1.75) 23(4.25,2.25) 24(4.25,2.75) 37(-4.25,2.75) 38(-4.25,2.25) 39(-4.25,1.75) 40(-4.25,1.25) 41(-4.25,0.75) 42(-4.25,0.25) 43(-4.25,-0.25) 44(-4.25,-0.75) 45(-4.25,-1.25) 46(-4.25,-1.75) 47(-4.25,-2.25) 48(-4.25,-2.75)
footprint_3a94
  rect 0.8x0.8 smd: 1(0.851,0) 2(-0.851,0)
footprint_5b8b
  round 1.524 hole 0.762: 1(-2.54,-1.27) 2(0,1.27) 3(2.54,-1.27)
footprint_9e9b
  rect 0.8x0.9 smd: 1(-0.7,0) 2(0.7,0)
footprint_17ac
  round 1.524 hole 0.914: 1(2.75,1.27) 2(2.75,-1.27) 3(-2.75,-1.27) 4(-2.75,1.27)
footprint_40fb
  rect 1.25x0.7 smd: 1(1,-0.95) 2(1,0.95) 3(-1,0)
footprint_45c2
  round 1.6 hole 1: 1(-1.27,0) 2(1.27,0)
footprint_217f
  rect 1.2x0.95 smd: 1(-1.7,0) 2(1.7,0)
footprint_1582
  rect 1.7x1.575 hole 1.1: 1(-17.78,0)
  round 1.7 hole 1.1: 2(-15.24,0) 3(-12.7,0) 4(-10.16,0) 5(-7.62,0) 6(-5.08,0) 7(-2.54,0) 8(0,0) 9(2.54,0) 10(5.08,0) 11(7.62,0) 12(10.16,0) 13(12.7,0) 14(15.24,0) 15(17.78,0)
footprint_2996
  rect 0.95x1.15 smd: 1(-1.692,0) 2(1.692,0)
footprint_5031
  rect 1.4x1.5 smd: 1(-3.8,0) 2(3.8,0)
footprint_6934
  oval 0.63x1.865 smd: 1(-1.905,-2.683) 2(-0.635,-2.683) 3(0.635,-2.683) 4(1.905,-2.683) 5(1.905,2.683) 6(0.635,2.683) 7(-0.635,2.683) 8(-1.905,2.683)
footprint_7788
  round 1.524 hole 0.762: 1(0,1.7) 2(0,-1.7)
footprint_a6c7
  rect 1.7x1.7 hole 1.1: 1(-3.81,0)
  round 1.7 hole 1.1: 2(-1.27,0) 3(1.27,0) 4(3.81,0)
footprint_b725
  round 1.8 hole 1: 1(-2.5,0) 2(2.5,0)
footprint_c089
  oval 0.574x2.038 smd: 1(-1.905,-2.769) 2(-0.635,-2.769) 3(0.635,-2.769) 4(1.905,-2.769) 5(1.905,2.769) 6(0.635,2.769) 7(-0.635,2.769) 8(-1.905,2.769)
  rect 3.2x2.4 smd: 9(0,0)
footprint_c90a
  round 1.8 hole 1.05: 1(-13.97,0) 2(-11.43,0) 3(-8.89,0) 4(-6.35,0) 5(-3.81,0) 6(-1.27,0) 7(1.27,0) 8(3.81,0) 9(6.35,0) 10(8.89,0) 11(11.43,0) 12(13.97,0)
footprint_d2a7
  rect 1.575x1.7 hole 1.1: 1(-8.89,0)
  round 1.7 hole 1.1: 2(-6.35,0) 3(-3.81,0) 4(-1.27,0) 5(1.27,0) 6(3.81,0) 7(6.35,0) 8(8.89,0)
footprint_ff81
  rect 0.806x0.864 smd: 1(-0.753,0) 2(0.753,0)
HDR-TH_04P-P2.54-H-M-W10.4-N
  round 1.7 hole 1.1: 1(-3.81,0) 2(-1.27,0) 3(1.27,0) 4(3.81,0)
R0603
  rect 0.806x0.864 smd: 1(-0.753,0) 2(0.753,0)

## Nets
As in the schematic, except:
GND: C1.2 C2.1 C3.1 C4.1 C5.1 C6.1 C7.1 C8.1 C9.1 C10.2 C11.2 C12.2 C13.2 C14.1 C15.1 C16.1 C17.1 C18.2 C19.1 C20.1 C21.1 C22.1 CN1.2 H1.2 H2.2 J1.2 J2.2 J3.1 J4.1 J5.2 Q1.2 R2.1 R7.1 R10.1 R11.1 R17.1 R24.1 R39.2 SW1.2 U1.8 U1.23 U1.35 U1.47 U2.1 U4.4 U4.9 U7.2 U7.3 U8.8 U10.2
$1N2466: C15.2 R4.2 R5.2 R17.3 R31.2 R32.2 U8.4

Pads without a net: J1 3 13 14; J2 12 13; J5 5 6 7; U1 2 3 4 5 6 10 11 14 16 17 19 20 27 28 29 32 33 38 39 40 41 42 43 45 46; U4 3 5 6 7; U8 5 6 7

## Via types
v1: diameter 0.61, hole 0.305, Top Layer to Bottom Layer, 500 vias

## Routing (per net, layer and track width the routed paths; a pad name or vN(x,y) marks a point on that pad's centre or on a via; arc(x,y) is an arc through that point)
GND: length 120.4
  Top Layer w0.254: U2.1 46.27,72.9 v1(45.09,72.9) ; v1(26.67,67.02) U1.35 29.76,67.02 30.1,66.67 31.69,66.67 C12.2 ; U1.23 v1(26.16,62.1) ; U1.8 v1(21.08,64.02) ; v1(21.66,67.56) U1.47
  Top Layer w0.508: C1.2 v1(77.28,4.83) ; J2.2 v1(15.25,50.42) ; C3.1 71.48,61.72 v1(72.64,61.72) ; C15.1 v1(72.52,24.89) ; 21.12,73.11 21.08,73.14 v1(21.08,73.91) ; C6.1 v1(50.48,59.06) ; 69.32,61.76 v1(70.36,61.76) ; 68.96,25.84 68.71,25.59 v1(68.71,24.89) ; C19.1 v1(17.81,74.42) ; U4.4 v1(38.99,56.26) ; R2.1 v1(77.72,10.59) ; C11.2 v1(14.48,63.5) ; 17.33,72.78 16.76,72.78 ; 17.33,72.78 16.76,72.78 ; 17.33,72.78 v1(17.81,72.78) ; 16.76,72.78 R24.1 16.76,72.78 ; 74.56,33.02 v1(76.2,33.02) ; v1(15.24,75.95) 15.24,77.6 J1.2 ; C17.1 v1(64.25,53.21) ; 70.6,55.53 70.6,54.41 70.59,54.41 ; v1(27.94,55.75) 27.56,55.75 26.8,56.52 C13.2 ; R39.2 v1(22.73,73.02) ; J4.1 v1(66.42,78.66) ; J3.1 v1(52.96,38.1) C16.1 ; H2.2 v1(77.22,59.28) ; C9.1 v1(47.24,64.26) ; v1(54.48,5.21) 54.16,5.53 Q1.2 ; R11.1 v1(70.47,46.9) 71.42,46.9 C7.1 71.59,46.86 v1(73.15,46.86) ; v1(68.53,58.84) 68.56,58.81 U10.2 ; C21.1 v1(68.26,75.06) ; v1(64.39,47.37) 64.77,46.99 66.25,46.99 C4.1 ; H1.2 79.11,70.1 v1(77.22,70.1) ; C10.2 v1(14.48,68.58) ; C18.2 v1(72.64,69.47) ; v1(41.21,72.14) 41.21,73.15 ; J5.2 v1(67.06,41.4) ; 48.26,64.07 v1(49.28,64.07) ; C12.2 v1(32.58,68.71) ; CN1.2 v1(73.41,52.17) ; C22.1 v1(14.48,65.28) ; C5.1 v1(35.56,60.45) ; SW1.2 v1(66.04,63.25)
  Bottom Layer w0.508: v1(49.28,64.07) 49.28,64.01 ; v1(39.37,76.33) 39.62,76.07 60.71,76.07 v1(61.81,74.97) 63.25,73.53 63.25,50.91 64.75,49.4 v1(64.9,49.4) ; v1(77.72,10.59) 77.72,10.67
  vias: v1(2.54,80.64) v1(2.84,78.44) v1(2.84,73.36) v1(2.84,68.28) v1(2.84,63.19) v1(2.84,58.11) v1(2.84,53.03) v1(2.84,47.95) v1(2.84,37.8) v1(2.84,32.72) v1(2.84,27.64) v1(2.84,22.56) v1(2.84,17.47) v1(2.84,12.4) v1(2.84,7.31) v1(2.84,2.24) v1(5.39,2.24) v1(6.35,80.64) v1(7.92,78.44) v1(7.92,73.36) v1(7.92,68.28) v1(7.92,63.19) v1(7.92,58.11) v1(7.92,53.03) v1(7.92,47.95) v1(7.92,42.88) v1(7.92,37.8) v1(7.92,32.72) v1(7.92,27.64) v1(7.92,22.56) v1(7.92,17.47) v1(7.92,12.4) v1(7.92,7.31) v1(7.92,2.24) v1(10.47,78.44) v1(10.47,2.24) v1(10.8,80.64) v1(12.7,54.36) v1(13,73.36) v1(13,70.81) v1(13,58.11) v1(13,47.95) v1(13,42.88) v1(13,37.8) v1(13,32.72) v1(13,27.64) v1(13,22.56) v1(13,17.47) v1(13,12.4) v1(13,7.31) v1(13,2.24) v1(14.48,66.93) v1(15.24,80.64) v1(15.55,58.11) v1(15.55,2.24) v1(17.25,54.36) v1(18.09,58.11) v1(18.09,42.88) v1(18.09,37.8) v1(18.09,32.72) v1(18.09,27.64) v1(18.09,22.56) v1(18.09,17.47) v1(18.09,12.4) v1(18.09,7.31) v1(18.09,2.24) v1(19.81,68.83) v1(19.94,47.62) v1(20.19,54.36) v1(20.32,80.64) v1(20.62,58.11) v1(20.62,2.24) v1(21.72,62.36) v1(22.86,58.67) v1(22.86,54.36) v1(23.11,47.62) v1(23.16,65.73) v1(23.16,63.19) v1(23.16,42.88) v1(23.16,37.8) v1(23.16,32.72) v1(23.16,27.64) v1(23.16,22.56) v1(23.16,17.47) v1(23.16,12.4) v1(23.16,7.31) v1(23.16,2.24) v1(24.44,58.67) v1(24.64,67.06) v1(24.76,54.36) v1(25.27,70.61) v1(25.4,80.64) v1(25.4,72.77) v1(25.71,65.73) v1(25.71,63.19) v1(25.71,50.5) v1(25.71,2.24) v1(26.61,47.62) v1(27.81,69.09) v1(28.25,75.89) v1(28.25,60.66) v1(28.25,42.88) v1(28.25,37.8) v1(28.25,32.72) v1(28.25,27.64) v1(28.25,22.56) v1(28.25,17.47) v1(28.25,12.4) v1(28.25,7.31) v1(28.25,2.24) v1(28.57,72.77) v1(29.59,50.55) v1(29.57,47.62) v1(30.1,69.09) v1(30.48,80.64) v1(30.78,58.11) v1(30.78,45.42) v1(30.78,2.24) v1(31.75,76.07) v1(33.32,58.11) v1(33.32,50.5) v1(33.32,42.88) v1(33.32,37.8) v1(33.32,32.72) v1(33.32,27.64) v1(33.32,22.56) v1(33.32,17.47) v1(33.32,12.4) v1(33.32,7.31) v1(33.32,2.24) v1(33.4,47.62) v1(34.04,72.01) v1(34.29,76.07) v1(35.05,69.85) v1(35.05,56.26) v1(35.56,80.64) v1(35.87,14.94) v1(35.87,12.4) v1(35.87,9.85) v1(35.87,7.31) v1(35.87,2.24) v1(36.83,76.33) v1(36.83,40.51) v1(36.83,36.32) v1(36.83,31.65) v1(36.83,26.16) v1(36.83,20.83) v1(37.08,49.15) v1(37.08,47.62) v1(38.1,57.4) v1(38.43,72.01) v1(38.41,12.4) v1(38.41,9.85) v1(38.41,7.31) v1(38.41,2.24) v1(38.74,37.97) v1(38.74,28.7) v1(38.74,20.83) v1(40.64,80.64) v1(40.94,45.42) v1(40.94,42.88) v1(40.94,17.47) v1(40.94,9.85) v1(40.94,7.31) v1(40.94,2.24) v1(41.02,49.15) v1(41.02,47.62) v1(42.04,31.62) v1(42.04,26.16) v1(42.04,20.83) v1(42.16,36.32) v1(42.67,61.34) v1(43.05,56.39) v1(43.49,20.01) v1(43.49,7.31) v1(43.49,2.24) v1(43.69,61.34) v1(44.04,56.39) v1(44.58,22.1) v1(44.58,19.05) v1(44.58,16.51) v1(44.58,13.98) v1(44.58,11.43) v1(44.83,61.34) v1(45.72,80.64) v1(46.03,45.42) v1(46.03,42.88) v1(46.03,40.33) v1(46.03,37.8) v1(46.03,35.25) v1(46.03,32.72) v1(46.03,30.17) v1(46.03,27.64) v1(46.03,25.09) v1(46.03,7.31) v1(46.03,2.24) v1(46.35,61.34) v1(47.37,50.42) v1(47.37,47.75) v1(48.64,56.26) v1(48.56,45.42) v1(48.56,42.88) v1(48.56,40.33) v1(48.56,37.8) v1(48.56,35.25) v1(48.56,32.72) v1(48.56,30.17) v1(48.56,7.31) v1(48.56,2.24) v1(48.98,61.34) v1(49.69,50.42) v1(50.29,72.64) v1(50.84,80.64) v1(51.1,78.44) v1(51.1,58.11) v1(51.1,42.88) v1(51.1,40.33) v1(51.1,2.24) v1(52.45,76.83) v1(52.96,26.8) v1(52.96,24.13) v1(52.96,21.72) v1(52.96,19.08) v1(52.96,16.51) v1(52.96,13.97) v1(52.96,11.43) v1(53.65,78.44) v1(53.59,64.26) v1(53.65,60.66) v1(53.65,58.11) v1(53.65,55.58) v1(53.65,50.5) v1(53.65,47.95) v1(53.65,32.72) v1(53.65,30.17) v1(53.65,2.24) v1(55.34,72.64) v1(56.19,78.44) v1(56.19,76.83) v1(56.19,63.19) v1(56.19,2.24) v1(57.18,80.64) v1(57.15,54.99) v1(57.28,60.33) v1(57.28,48.64) v1(57.91,30.23) v1(58.72,78.44) v1(58.72,27.64) v1(58.72,25.09) v1(58.72,22.56) v1(58.72,20.01) v1(58.72,17.47) v1(58.72,14.94) v1(58.72,12.4) v1(58.72,9.85) v1(58.72,4.78) v1(58.72,2.24) v1(59.82,76.83) v1(61.26,27.64) v1(61.26,25.09) v1(61.26,22.56) v1(61.26,20.01) v1(61.26,17.47) v1(61.26,14.94) v1(61.26,12.4) v1(61.26,9.85) v1(61.26,4.78) v1(61.26,2.24) v1(61.47,78.61) v1(62.1,47.88) v1(62.23,34.8) v1(62.23,30.23) v1(62.36,42.8) v1(62.74,40.77) v1(62.74,38.86) v1(62.9,52.05) v1(63.37,77.98) v1(63.81,63.19) v1(63.81,60.66) v1(63.81,58.11) v1(63.81,55.58) v1(63.81,27.64) v1(63.81,25.09) v1(63.81,22.56) v1(63.81,20.01) v1(63.81,17.47) v1(63.81,14.94) v1(63.81,12.4) v1(63.81,4.78) v1(63.81,2.24) v1(64.77,80.64) v1(66.34,40.33) v1(66.34,25.09) v1(66.34,22.56) v1(66.34,20.01) v1(66.34,17.47) v1(66.34,14.94) v1(66.34,12.4) v1(66.34,9.85) v1(66.34,7.31) v1(66.34,2.24) v1(67.34,52.24) v1(67.59,58.85) v1(67.56,53.85) v1(67.69,72.52) v1(67.69,68.83) v1(68.88,63.19) v1(68.88,45.42) v1(68.88,40.33) v1(68.88,22.56) v1(68.88,20.01) v1(68.88,17.47) v1(68.88,12.4) v1(68.88,4.78) v1(68.88,2.24) v1(69.53,58.84) v1(69.84,50.86) v1(70.6,54.4) v1(71.43,70.81) v1(71.43,68.28) v1(71.43,42.88) v1(71.43,32.72) v1(71.43,30.17) v1(71.43,14.94) v1(71.43,9.85) v1(71.43,7.31) v1(71.43,4.78) v1(71.43,2.24) v1(71.63,75.31) v1(71.81,80.64) v1(73.97,70.81) v1(73.97,63.19) v1(73.97,60.66) v1(73.97,58.11) v1(73.97,55.58) v1(73.97,53.03) v1(73.97,50.5) v1(73.97,45.42) v1(73.97,42.88) v1(73.97,40.33) v1(73.97,12.4) v1(73.97,7.31) v1(73.97,2.24) v1(76.5,75.89) v1(76.5,70.81) v1(76.5,63.19) v1(76.5,60.66) v1(76.5,58.11) v1(76.5,55.58) v1(76.5,53.03) v1(76.5,50.5) v1(76.5,47.95) v1(76.5,45.42) v1(76.5,40.33) v1(76.5,35.25) v1(76.5,30.17) v1(76.5,22.56) v1(76.5,12.4) v1(76.5,2.24) v1(77.47,80.64) v1(79.04,78.44) v1(79.04,53.03) v1(79.04,50.5) v1(79.04,47.95) v1(79.04,45.42) v1(78.99,42.93) v1(79.04,40.33) v1(79.04,37.8) v1(79.04,35.25) v1(79.04,32.72) v1(79.04,30.17) v1(78.99,25.02) v1(79.04,22.56) v1(79.04,20.01) v1(79.04,14.94) v1(79.04,9.85) v1(79.04,7.31) v1(79.04,4.78) v1(79.04,2.24) v1(81.59,78.44) v1(81.59,75.89) v1(81.59,73.36) v1(81.59,70.81) v1(81.59,68.28) v1(81.59,55.58) v1(81.59,53.03) v1(81.59,50.5) v1(81.59,47.95) v1(81.59,45.42) v1(81.59,42.88) v1(81.59,40.33) v1(81.59,37.8) v1(81.59,35.25) v1(81.59,32.72) v1(81.59,30.17) v1(81.59,27.64) v1(81.59,25.09) v1(81.59,22.56) v1(81.59,20.01) v1(81.59,17.47) v1(81.59,14.94) v1(81.59,12.4) v1(81.59,9.85) v1(81.59,7.31) v1(81.59,4.78) v1(81.59,2.24) v1(82.55,80.01)
V33: length 12.2
  Top Layer w0.508: U4.1 38.42,60.07 C5.2 38.09,60.5 38.09,61.28 ; R13.1 43.19,62.61 ; 43.19,62.61 41.7,62.61 Q3.2 40.37,61.28 38.09,61.28 ; 43.19,62.61 R14.1 ; 38.09,61.28 R26.2
VBAT: length 17.5
  Top Layer w0.508: R12.2 69.63,48.36 71.49,48.36 ; CN1.1 73.93,48.36 71.49,48.36 ; 71.49,48.36 71.54,48.41 D2.2 71.54,52.55 Q2.3 71.75,53.66 71.75,56.52 70.72,57.55 U10.3
VBUS: length 55.9
  Top Layer w0.508: Q2.2 68.14,51.1 D2.1 66.48,50.33 66.28,50.54 66.14,50.67 v1(65.28,50.67) 56.39,50.67 49.08,57.98 C6.2 v1(48.01,60.07) U4.8 ; v1(36.58,57.78) 36.58,58.79 R16.2 ; 70.6,43.94 v1(72.01,43.94) ; 64.68,50.94 63.98,50.94
  Bottom Layer w0.508: v1(72.01,43.94) 72.01,46.86 68.2,50.67 v1(65.28,50.67) ; v1(36.58,57.78) 38.86,60.07 v1(48.01,60.07)
VCC3V3: length 236.4
  Top Layer w0.254: 26.66,59.31 U1.24 ; 31.18,67.56 31.13,67.52 U1.36 ; U1.9 18.57,63.52 ; U1.48 21.16,70.12 ; U1.1 18.57,67.52
  Top Layer w0.508: J3.2 55.81,35.5 51.37,35.5 v1(51.31,35.56) ; 26.66,59.31 26.66,58.11 C13.1 27.88,57.98 29.84,59.94 v1(31.18,59.94) ; v1(31.18,68.71) 31.18,67.56 ; D4.1 69.93,69.01 v1(69.47,69.47) C18.1 ; R38.1 v1(30.1,63.5) ; v1(31.18,59.94) 31,60.12 R37.1 ; v1(31.18,59.94) 33.27,59.94 34.04,60.71 34.04,63.25 36.7,65.91 v1(58.29,65.91) 67.18,65.91 v1(68.33,64.77) ; Q3.3 42.81,64.5 R14.2 44.76,64.13 C9.2 44.89,65.84 ; 21.16,70.12 21.16,71.48 21.14,71.5 ; R32.1 R34.1 R33.1 v1(70.73,39.88) ; C11.1 v1(17.91,63.5) 17.92,63.52 18.57,63.52 ; 21.14,71.5 C14.2 20.89,71.56 v1(17.91,68.58) C10.1 16.96,66.98 R36.2 17.6,67.52 18.57,67.52 ; 21.14,71.5 v1(22.1,71.5) ; v1(51.31,3.81) R3.2 ; R15.1 v1(71.75,3.81) ; v1(62.74,45.47) v1(58.29,45.47)
  Bottom Layer w0.508: v1(17.91,63.5) v1(17.91,68.58) ; v1(62.74,45.47) 66.42,45.47 70.73,41.16 v1(70.73,39.88) ; v1(22.1,71.5) 29.21,71.5 31.18,69.53 v1(31.18,68.71) 31.18,63.52 ; v1(58.29,65.91) v1(58.29,45.47) 58.29,43.05 56.13,40.89 53.02,40.89 51.31,39.18 v1(51.31,35.56) v1(51.31,3.81) v1(71.75,3.81) ; v1(68.33,64.77) 69.47,65.91 v1(69.47,69.47) 69.47,75.82 70.74,77.08 70.74,78.66 ; 70.78,78.93 70.81,78.9 ; v1(30.1,63.5) 31.16,63.5 31.18,63.52 ; v1(31.18,59.94) 31.18,63.52
VDD3V3: length 140.8
  Top Layer w0.508: C20.2 42.61,73.34 41.16,74.79 41.16,74.8 ; C20.2 v1(42.61,72.14) ; C20.2 43.45,73.03 U2.3 ; R29.2 37.85,74.93 36.33,73.41 R35.2 ; v1(54.86,71.5) 61.22,71.5 R28.2 ; v1(49.28,62.67) C8.2 48.2,62.61 R13.2 ; R6.2 v1(72.01,35.05) R31.1 ; v1(56.26,46.36) v1(62.74,46.36)
  Bottom Layer w0.508: 55.18,62.67 v1(49.28,62.67) 39.31,62.67 33.27,56.64 17.15,56.64 J2.1 ; 55.18,62.67 54.86,62.99 v1(54.86,71.5) 43.25,71.5 v1(42.61,72.14) ; 55.18,62.67 56.26,61.59 v1(56.26,46.36) ; v1(62.74,46.36) 66.68,46.36 72.01,41.02 v1(72.01,35.05)
VIN: length 95.1
  Top Layer w0.508: v1(72.63,60.3) C3.2 71.3,60.14 U10.4 ; 66.28,53.94 66.28,55.29 R8.2 65.98,55.49 v1(65,55.49) ; v1(65,61.85) 65,61.85 LED1.1 ; R25.2 12.09,76.99 J1.1
  Bottom Layer w0.508: J1.1 12.71,79.21 13.21,79.7 63.17,79.7 65,77.88 v1(65,61.85) 65,60.28 ; 65,60.28 65.02,60.3 v1(72.63,60.3) ; 65,60.28 v1(65,55.49)
ADC_LIGHT: length 107.6
  Top Layer w0.254: v1(62.23,27.94) v1(62.23,24.26) ; 75.88,6.92 75.91,6.89 75.91,3.88 ; R15.2 C1.1
  Bottom Layer w0.254: R2.2 67.13,15.88 63.37,15.88 62.23,17.02 v1(62.23,24.26) ; J1.10 35.56,77.6 35.56,75.69 36.3,74.95 59.54,74.95 61.09,73.41 61.09,29.08 v1(62.23,27.94)
ADC_VBAT: length 58.4
  Top Layer w0.254: R11.2 68.07,46.92 R12.1 66.34,48.43 66.28,48.36 66.26,48.39 v1(64.9,48.39)
  Bottom Layer w0.254: J1.11 38.1,77.6 38.1,75.95 38.61,75.44 60.07,75.44 61.98,73.53 61.98,49.99 63.58,48.39 v1(64.9,48.39)
ESP32_EN: length 2.8
  Top Layer w0.254: R30.1 48.26,77.6 J1.15
ESP32_RX1: length 28.8
  Top Layer w0.254: 28.19,77.6 25.29,74.69 19.97,74.69 19.33,74.06 19.33,72.17 17.65,70.48 14.86,70.48 13.23,68.86 13.23,62.23 13.86,61.59 15.4,61.59
ESP32_TX1: length 28.6
  Top Layer w0.254: 15.4,59.94 13.99,59.94 12.59,61.34 12.59,69.11 14.61,71.12 17.4,71.12 18.67,72.39 18.67,74.28 19.59,75.2 23.01,75.2 J1.6
H1_1: length 18.1
  Top Layer w0.508: D4.2 73.34,67.55 H1.1 80.9,65.77 80.9,58.52 H2.1
H1_3: length 7.5
  Top Layer w0.254: H1.3 72.11,72.63 R18.2
H1_4: length 7.8
  Top Layer w0.254: 79.03,75.11 77.83,73.91 R19.2
H2_3: length 8.3
  Top Layer w0.254: R22.2 76.93,64.01 H2.3
H2_4: length 7.9
  Top Layer w0.254: R23.2 77.82,65.66 H2.4
KEY_WEAKUP: length 32.8
  Top Layer w0.254: 66.04,73.91 SW1.1 ; 66.04,73.91 R28.1 ; 66.04,73.91 C21.2 66.86,74.68 66.48,75.06 v1(63.37,75.06)
  Bottom Layer w0.254: 40.89,77.6 42.42,79.12 59.31,79.12 v1(63.37,75.06)
MPU_SCL: length 65.9
  Top Layer w0.254: 66.55,38.73 65.02,38.73 J5.3 ; 66.55,38.73 R33.2 ; 66.55,38.73 66.68,38.61 66.68,35.56 66.17,35.05 64.13,35.05 50.8,48.39 50.8,53.59 50.04,54.36 26.19,54.36 25.16,55.38 U1.21
MPU_SDA: length 59.7
  Top Layer w0.254: R34.2 v1(68.2,36.96) ; U1.22 25.66,55.77 26.53,54.9 50.25,54.9 51.31,53.85 51.31,48.64 63.63,36.32 J5.4
  Bottom Layer w0.254: J5.4 67.56,36.32 v1(68.2,36.96)
MPU_WEAKUP: length 86.5
  Top Layer w0.254: R35.1 30.49,74.93 J1.8
  Bottom Layer w0.254: J5.8 61.21,26.16 59.18,28.19 59.18,73.41 58.78,73.8 31.61,73.8 30.48,74.93 30.48,77.6 J1.8
NRST: length 5.3
  Top Layer w0.254: R36.1 16.96,65.48 C22.2 17.72,64.52 U1.7
OBJ_LIGHT: length 82.5
  Top Layer w0.254: R6.1 69.22,33.04 69.2,33.02 67.69,33.02 67.18,32.51 v1(60.07,32.51)
  Bottom Layer w0.254: J1.9 33.02,77.6 33.02,75.18 33.76,74.44 59.04,74.44 60.07,73.41 v1(60.07,32.51)
OLED_SCL: length 57.2
  Top Layer w0.254: J4.3 71.57,76.96 60.96,76.96 v1(57.02,73.03) ; v1(57.02,67.18) 36.96,67.18 33.4,63.63 33.4,61.98 R37.2 31.57,62.02 U1.25
  Bottom Layer w0.254: v1(57.02,67.18) v1(57.02,73.03)
OLED_SDA: length 59.8
  Top Layer w0.254: J4.4 73.48,76.33 61.59,76.33 v1(58.29,73.03) ; v1(58.29,67.18) 57.53,67.94 36.96,67.94 31.53,62.52 31.52,62.52 ; 31.52,62.52 U1.26 ; 31.52,62.52 R38.2
  Bottom Layer w0.254: v1(58.29,73.03) v1(58.29,67.18)
PWR_EN: length 26.5
  Top Layer w0.254: v1(35.56,62.36) 35.57,62.37 R27.2
  Bottom Layer w0.254: J1.4 20.33,75.81 22.22,73.91 29.08,73.91 35.56,67.44 v1(35.56,62.36)
RING: length 103.7
  Top Layer w0.254: U1.15 22.16,57.81 20.35,56 12.08,56 10.81,54.72 10.81,6.64 11.73,5.72 R1.2
STM32_RXD1: length 45.4
  Top Layer w0.254: R23.1 69.34,65.66 65.66,69.34 36.83,69.34 32.51,65.02 U1.31
STM32_RXD2: length 4.5
  Top Layer w0.254: 16.91,59.94 17.49,60.52 U1.13
STM32_TXD1: length 45.8
  Top Layer w0.254: U1.30 32.77,64.52 36.96,68.71 65.54,68.71 R22.1
STM32_TXD2: length 2.8
  Top Layer w0.254: U1.12 17.31,62.02 R21.2
SWCLK: length 46.5
  Top Layer w0.254: R19.1 70.23,73.91 68.71,72.39 68.71,72.03 67.41,70.74 27.21,70.74 26.66,70.19 U1.37
SWDIO: length 44.9
  Top Layer w0.254: U1.34 29.37,66.52 29.84,66.04 32.77,66.04 36.7,69.98 67.94,69.98 70.23,72.26 R18.1
TFT_BLK: length 45.2
  Top Layer w0.254: 56.26,20.32 44.83,20.32 43.12,22.03 v1(43.12,44.68)
  Bottom Layer w0.254: v1(43.12,44.68) 43.12,49.34 45.97,52.2
TFT_CS: length 65.9
  Top Layer w0.254: 18.03,52.2 17.81,51.97 17.81,47.98 19.44,46.36 43.56,46.36 43.94,45.97 43.94,24.27 45.35,22.86 56.26,22.86
TFT_DC: length 59.6
  Top Layer w0.254: 20.57,52.2 20.48,52.1 20.48,48.87 22.49,46.86 44.07,46.86 44.83,46.1 44.83,27.7 47.06,25.47 56.19,25.47 56.26,25.4
TFT_K1: length 59.7
  Top Layer w0.254: v1(38.23,44.96) 35.74,42.47 35.74,16.95 42.53,10.16 56.26,10.16
  Bottom Layer w0.254: v1(38.23,44.96) 38.23,52.07 38.35,52.2
TFT_K2: length 56.3
  Top Layer w0.254: v1(38.03,42.77) 38.03,17.07 42.41,12.7 56.26,12.7
  Bottom Layer w0.254: v1(38.03,42.77) 35.57,45.23 35.57,51.95 35.81,52.2
TFT_K3: length 57
  Top Layer w0.254: v1(39.5,41.15) 39.5,17.77 42.03,15.24 56.26,15.24
  Bottom Layer w0.254: v1(39.5,41.15) 37.49,41.15 30.73,47.9 30.73,52.2
TFT_K4: length 56.8
  Top Layer w0.254: 56.26,17.78 43.3,17.78 40.89,20.19 v1(40.89,39.62)
  Bottom Layer w0.254: 28.19,52.2 28.19,46.88 35.45,39.62 v1(40.89,39.62)
TFT_RST: length 54.3
  Top Layer w0.254: 23.11,52.2 22.9,51.98 22.9,50.27 24.78,48.39 45.21,48.39 47.62,45.97 47.62,29.46 49.15,27.94 56.26,27.94
TFT_SCL: length 37.7
  Top Layer w0.254: J2.9 35.34,49.89 46.76,49.89 57.78,38.86 57.78,33.53 57.28,33.02 J3.3
TFT_SDA: length 27.2
  Top Layer w0.254: J3.4 58.67,33.27 58.67,38.86 48.26,49.28 48.26,52.2
TURN_LIGHT: length 9
  Top Layer w0.254: U1.18 23.66,53.95 J2.6
USB_DET: length 12.3
  Top Layer w0.254: J1.5 20.98,75.71 16.58,75.71 C19.2 ; R24.2 15.29,72.82 C19.2 ; R25.1 15.27,74.44 C19.2
$1N12: length 20.9
  Top Layer w0.254: 69.2,30.48 68.07,30.48 67.69,30.1 67.69,28.26 C2.2 69.29,27.24 R4.1 71.75,24.77 71.75,16 72.6,15.16 U7.4
$1N13: length 12.4
  Top Layer w0.254: 69.29,31.74 67.9,31.74 66.93,30.77 66.93,27.43 67.44,26.92 R17.2
$1N15: length 5.2
  Top Layer w0.254: R5.1 74.55,25.54 U7.1
$1N25: length 18.1
  Top Layer w0.508: BUZZER1.1 64.69,3.64 D3.1 56.35,3.81 R3.1
$1N26: length 11.5
  Top Layer w0.508: Q1.3 55.02,7.03 D3.2 63.07,7.03 BUZZER1.2
$1N28: length 1.8
  Top Layer w0.254: 50.7,7.26 50.87,7.43 Q1.1
$1N42: length 1.9
  Top Layer w0.254: R9.2 67.14,57.07 U10.1
$1N45: length 3.1
  Top Layer w0.254: 69.09,53.95 69.08,53.96 R7.2 R8.1
$1N51: length 1.7
  Top Layer w0.254: R10.2 67.81,60.33 U10.5
$1N72: length 2.7
  Top Layer w0.254: U4.2 38.09,58.8
$1N77: length 1.6
  Top Layer w0.254: LED1.2 R9.1
$1N88: length 4.4
  Top Layer w0.254: Q3.1 39.69,63.56 39.38,63.87 R26.1 36.45,63.87
$1N98: length 6.3
  Top Layer w0.254: 42.66,74.93 42.73,74.86 U2.2 46.68,74.86 R30.2
$1N2466: length 31.6
  Top Layer w0.508: C15.2 72.46,27.3 R4.2 70.74,28.83 70.36,29.21 69.2,29.21 ; C15.2 72.57,27.3 R5.2 ; C15.2 v1(72.52,28.19) ; v1(75.95,36.96) R32.2 R31.2
  Bottom Layer w0.508: v1(75.95,36.96) 74.29,35.31 74.29,29.97 v1(72.52,28.19) 69.98,25.65 R17.3
$2N23: length 4.2
  Top Layer w0.508: R40.2 J5.1
$2N2076: length 2.8
  Top Layer w0.254: R39.1 23.16,70.8 U1.44

## Copper pours and planes (outline as drawn; the poured copper is in the pictures)
GND on Top Layer: 0,81.28 83.82,81.28 83.82,0 0,0
GND on Bottom Layer: 0,81.28 83.82,81.28 83.82,0 0,0

Small or netless copper shapes (teardrops, artwork), in the pictures only: 305 on Top Layer, 39 on Bottom Layer

## Text on the board
Top Silkscreen Layer: SWCLK | + | SWDIO | VCC | GND | TXD | ESP32_STM32_DISP_V0.1 | 1.8'' 128x160 TFT | ESP32 | OLED | BAT | MPU6050
